# EAGLE schematic STGHW00054_A2 (EAGLE 9.6.2)
Assembly variants: 00054A200000C, 00054A201001C, 00054A202010C, 00054A203011C

## Sheet 1 of 6: Baseband Processor Baseband LoRa demodulation processor and companion MCU
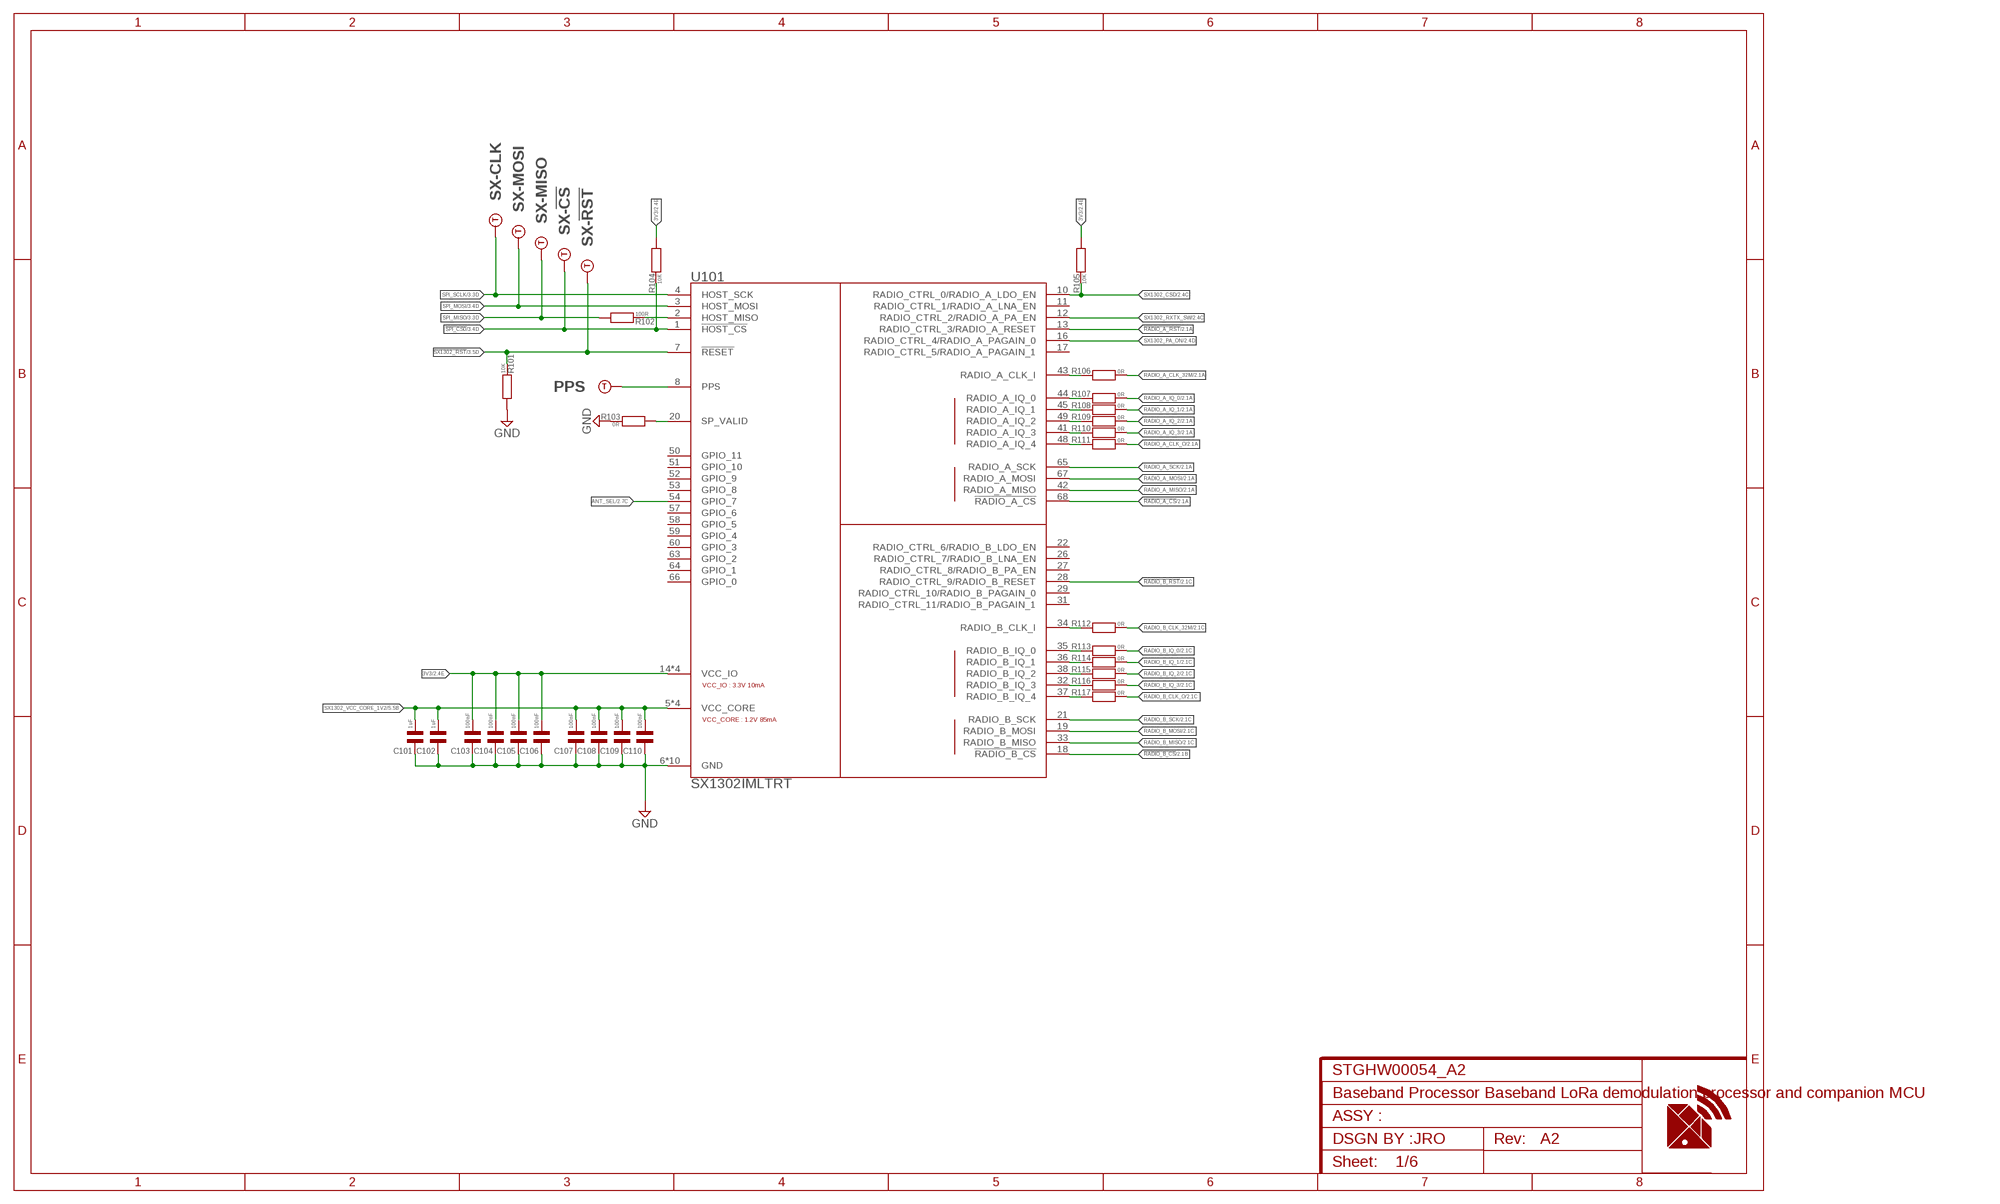
[diagram p0: schematic, sheet 1]

### Parts
C101  1uF  CAPACITOR-NP-0402  [C0402]
C102  1uF  CAPACITOR-NP-0402  [C0402]
C103  100nF  CAPACITOR-NP-0402  [C0402]
C104  100nF  CAPACITOR-NP-0402  [C0402]
C105  100nF  CAPACITOR-NP-0402  [C0402]
C106  100nF  CAPACITOR-NP-0402  [C0402]
C107  100nF  CAPACITOR-NP-0402  [C0402]
C108  100nF  CAPACITOR-NP-0402  [C0402]
C109  100nF  CAPACITOR-NP-0402  [C0402]
C110  100nF  CAPACITOR-NP-0402  [C0402]
PPS  TESPOINT-SMD1.5MM  [TESTPOINT-1.5MM]
R101  10K  RESISTOR-0402  [R0402]
R102  100R  RESISTOR-0402  [R0402]
R103  0R  RESISTOR-0402  [R0402]
R104  10K  RESISTOR-0402  [R0402]
R105  10K  RESISTOR-0402  [R0402]
R106  0R  RESISTOR-0402  [R0402]
R107  0R  RESISTOR-0402  [R0402]
R108  0R  RESISTOR-0402  [R0402]
R109  0R  RESISTOR-0402  [R0402]
R110  0R  RESISTOR-0402  [R0402]
R111  0R  RESISTOR-0402  [R0402]
R112  0R  RESISTOR-0402  [R0402]
R113  0R  RESISTOR-0402  [R0402]
R114  0R  RESISTOR-0402  [R0402]
R115  0R  RESISTOR-0402  [R0402]
R116  0R  RESISTOR-0402  [R0402]
R117  0R  RESISTOR-0402  [R0402]
SX-!CS!  TESPOINT-SMD1.5MM  [TESTPOINT-1.5MM]
SX-!RST!  TESPOINT-SMD1.5MM  [TESTPOINT-1.5MM]
SX-CLK  TESPOINT-SMD1.5MM  [TESTPOINT-1.5MM]
SX-MISO  TESPOINT-SMD1.5MM  [TESTPOINT-1.5MM]
SX-MOSI  TESPOINT-SMD1.5MM  [TESTPOINT-1.5MM]
U101  SX1302IMLTRT  [QFN35P700X700X80-69T556]

### Nets
3V3: C103.2 C104.2 C105.2 C106.2 R104.1 R105.1 U101.14(VCC_IO) U101.30(VCC_IO) U101.47(VCC_IO) U101.61(VCC_IO) ; also sheet 2,3,4,5,6
!RADIO_A_CS!: U101.68(!RADIO_A_CS!) ; also sheet 2
!RADIO_A_RST!: U101.13(RADIO_CTRL_3/RADIO_A_RESET) ; also sheet 2
!RADIO_B_CS!: U101.18(!RADIO_B_CS!) ; also sheet 2
!RADIO_B_RST!: U101.28(RADIO_CTRL_9/RADIO_B_RESET) ; also sheet 2
!SPI_CS0!: R104.2 SX-!CS!.1 U101.1(!HOST_CS!) ; also sheet 3
!SX1302_RST!: R101.2 SX-!RST!.1 U101.7(!RESET!) ; also sheet 3
ANT_SEL: U101.54(GPIO_7) ; also sheet 2
GND: C101.1 C102.1 C103.1 C104.1 C105.1 C106.1 C107.1 C108.1 C109.1 C110.1 R101.1 R103.2 U101.6(GND) U101.9(GND) U101.15(GND) U101.24(GND) U101.25(GND) U101.39(GND) U101.46(GND) U101.55(GND) U101.62(GND) U101.69(GND) ; also sheet 2,3,4,5,6
GPS_PPS: PPS.1 U101.8(PPS)
HOST_MISO: R102.2 U101.2(HOST_MISO)
RADIO_A_CLK_32M: R106.1 ; also sheet 2
RADIO_A_CLK_O: R111.1 ; also sheet 2
RADIO_A_IQ-0: R107.2 U101.44(RADIO_A_IQ_0)
RADIO_A_IQ-1: R108.2 U101.45(RADIO_A_IQ_1)
RADIO_A_IQ-2: R109.2 U101.49(RADIO_A_IQ_2)
RADIO_A_IQ-3: R110.2 U101.41(RADIO_A_IQ_3)
RADIO_A_IQ-4: R111.2 U101.48(RADIO_A_IQ_4)
RADIO_A_IQ_0: R107.1 ; also sheet 2
RADIO_A_IQ_1: R108.1 ; also sheet 2
RADIO_A_IQ_2: R109.1 ; also sheet 2
RADIO_A_IQ_3: R110.1 ; also sheet 2
RADIO_A_MISO: U101.42(RADIO_A_MISO) ; also sheet 2
RADIO_A_MOSI: U101.67(RADIO_A_MOSI) ; also sheet 2
RADIO_A_SCK: U101.65(RADIO_A_SCK) ; also sheet 2
RADIO_ACLK_I: R106.2 U101.43(RADIO_A_CLK_I)
RADIO_B_CLK_32M: R112.1 ; also sheet 2
RADIO_B_CLK_I: R112.2 U101.34(RADIO_B_CLK_I)
RADIO_B_CLK_O: R117.1 ; also sheet 2
RADIO_B_IQ-0: R113.2 U101.35(RADIO_B_IQ_0)
RADIO_B_IQ-1: R114.2 U101.36(RADIO_B_IQ_1)
RADIO_B_IQ-2: R115.2 U101.38(RADIO_B_IQ_2)
RADIO_B_IQ-3: R116.2 U101.32(RADIO_B_IQ_3)
RADIO_B_IQ-4: R117.2 U101.37(RADIO_B_IQ_4)
RADIO_B_IQ_0: R113.1 ; also sheet 2
RADIO_B_IQ_1: R114.1 ; also sheet 2
RADIO_B_IQ_2: R115.1 ; also sheet 2
RADIO_B_IQ_3: R116.1 ; also sheet 2
RADIO_B_MISO: U101.33(RADIO_B_MISO) ; also sheet 2
RADIO_B_MOSI: U101.19(RADIO_B_MOSI) ; also sheet 2
RADIO_B_SCK: U101.21(RADIO_B_SCK) ; also sheet 2
SP_VALID: R103.1 U101.20(SP_VALID)
SPI_MISO: R102.1 SX-MISO.1 ; also sheet 3
SPI_MOSI: SX-MOSI.1 U101.3(HOST_MOSI) ; also sheet 3
SPI_SCLK: SX-CLK.1 U101.4(HOST_SCK) ; also sheet 3
SX1302_CSD: R105.2 U101.10(RADIO_CTRL_0/RADIO_A_LDO_EN) ; also sheet 2
SX1302_PA_ON: U101.16(RADIO_CTRL_4/RADIO_A_PAGAIN_0) ; also sheet 2
SX1302_RXTX_SW: U101.12(RADIO_CTRL_2/RADIO_A_PA_EN) ; also sheet 2
SX1302_VCC_CORE_1V2: C101.2 C102.2 C107.2 C108.2 C109.2 C110.2 U101.5(VCC_CORE) U101.23(VCC_CORE) U101.40(VCC_CORE) U101.56(VCC_CORE) ; also sheet 5
Unconnected: U101.11(RADIO_CTRL_1/RADIO_A_LNA_EN) U101.17(RADIO_CTRL_5/RADIO_A_PAGAIN_1) U101.22(RADIO_CTRL_6/RADIO_B_LDO_EN) U101.26(RADIO_CTRL_7/RADIO_B_LNA_EN) U101.27(RADIO_CTRL_8/RADIO_B_PA_EN) U101.29(RADIO_CTRL_10/RADIO_B_PAGAIN_0) U101.31(RADIO_CTRL_11/RADIO_B_PAGAIN_1) U101.50(GPIO_11) U101.51(GPIO_10) U101.52(GPIO_9) U101.53(GPIO_8) U101.57(GPIO_6) U101.58(GPIO_5) U101.59(GPIO_4) U101.60(GPIO_3) U101.63(GPIO_2) U101.64(GPIO_1) U101.66(GPIO_0)

### Notes on the sheet
- JRO | A2

## Sheet 2 of 6: Radio front end (RFE + LNA/AMP)
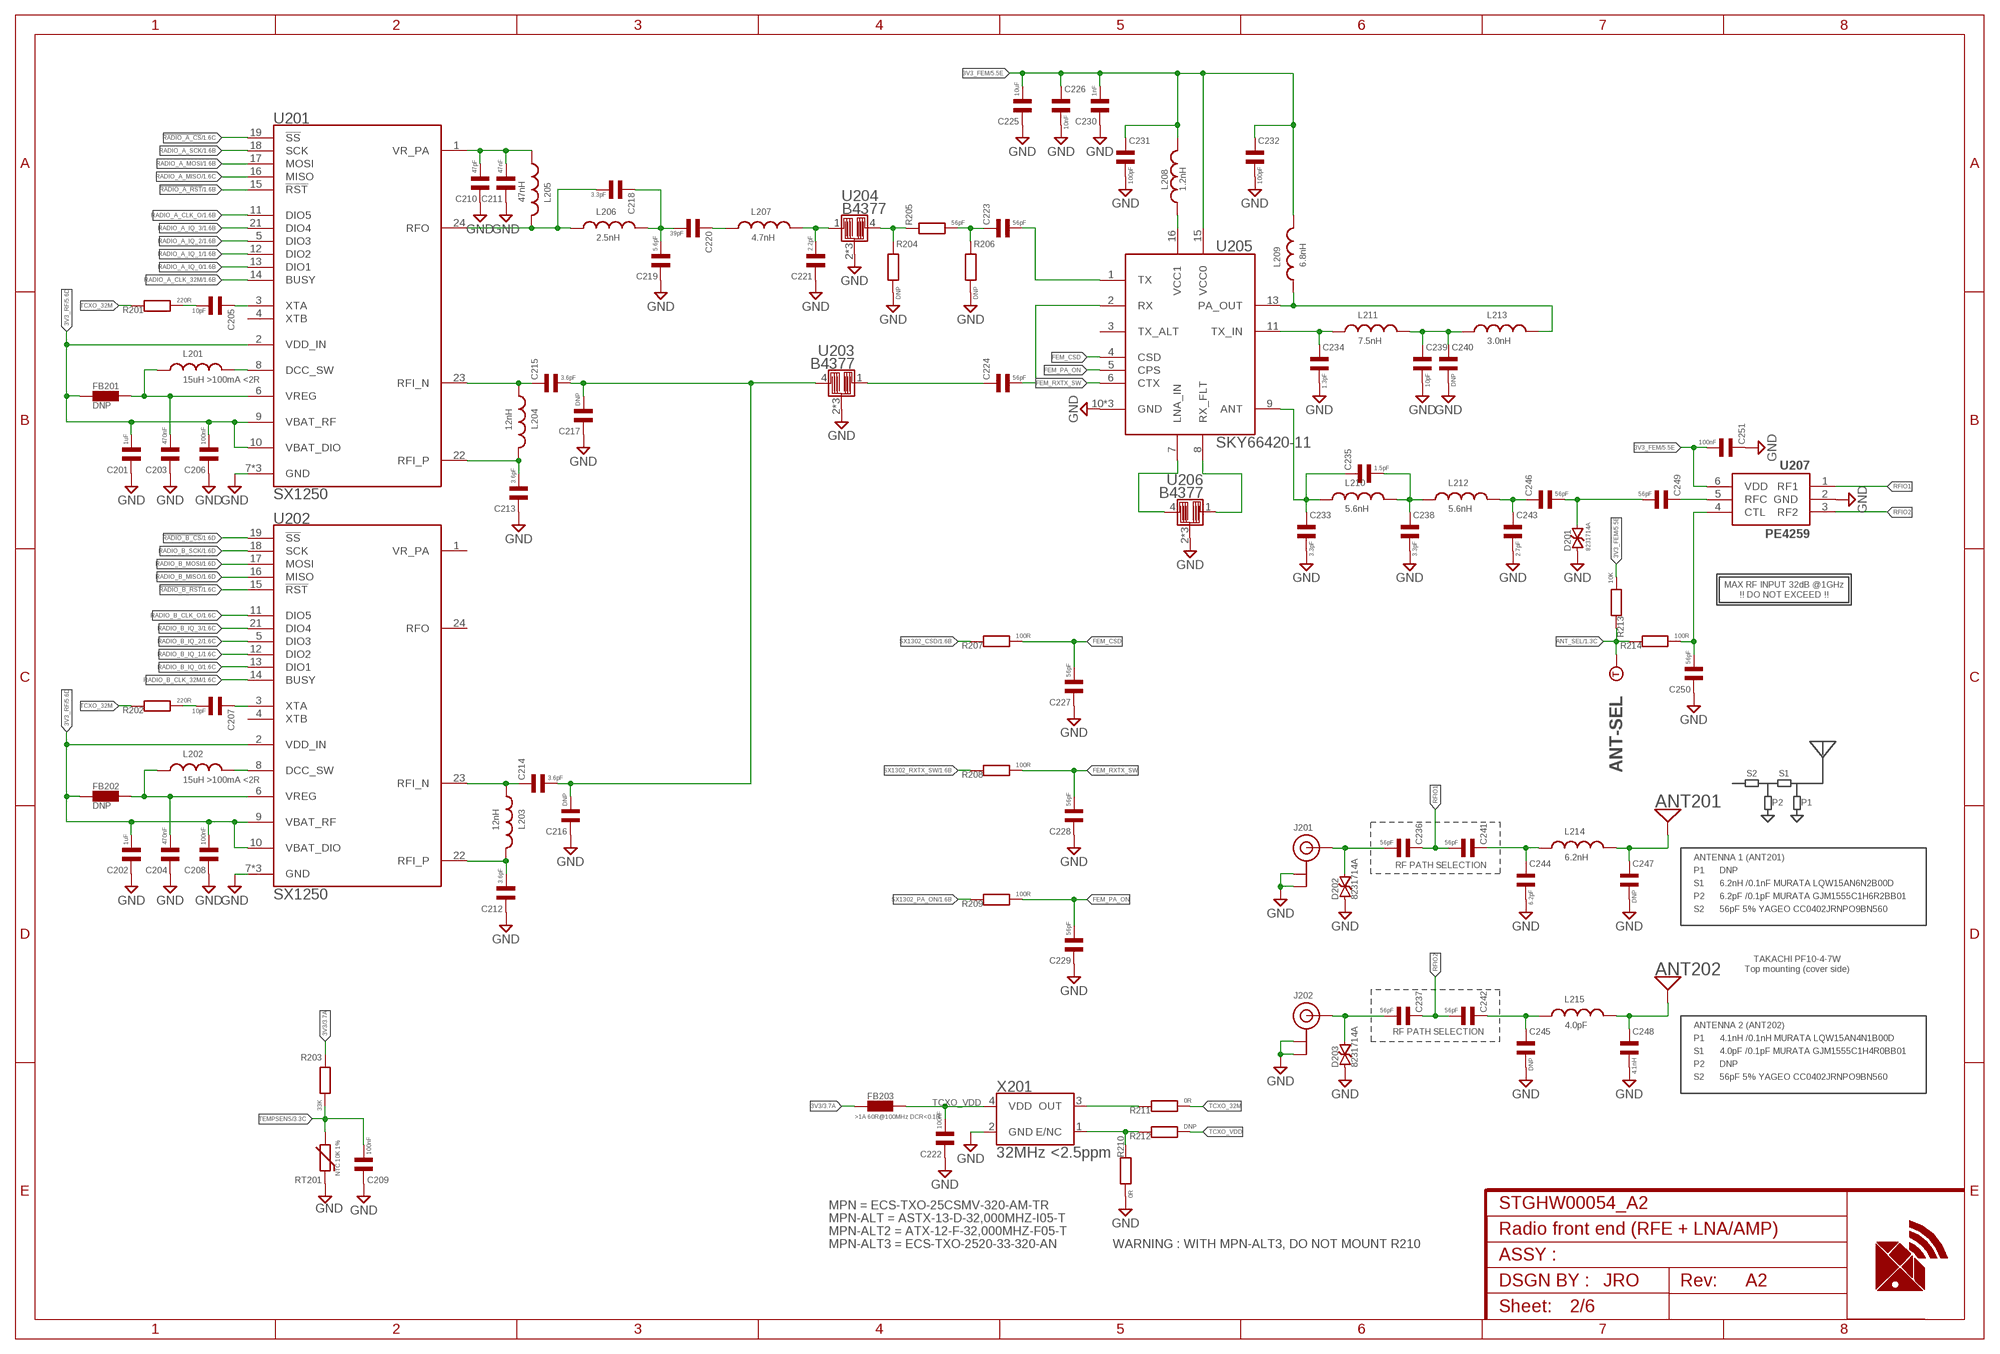
[diagram p1: schematic, sheet 2]

### Parts
ANT201  MLA-DN038  [DN038]
ANT202  MLA-DN038-MIRROR  [DN038_MIRROR]
ANT-SEL  TESPOINT-SMD1.5MM  [TESTPOINT-1.5MM]
C201  1uF  CAPACITOR-NP-0402  [C0402]
C202  1uF  CAPACITOR-NP-0402  [C0402]
C203  470nF  CAPACITOR-NP-0603  [C0603]
C204  470nF  CAPACITOR-NP-0603  [C0603]
C205  10pF  CAPACITOR-NP-0402  [C0402]
C206  100nF  CAPACITOR-NP-0402  [C0402]
C207  10pF  CAPACITOR-NP-0402  [C0402]
C208  100nF  CAPACITOR-NP-0402  [C0402]
C209  100nF  CAPACITOR-NP-0402  [C0402]
C210  47pF  CAPACITOR-NP-0402  [C0402]
C211  47nF  CAPACITOR-NP-0402  [C0402]
C212  3.6pF  CAPACITOR-NP-0402  [C0402]
C213  3.6pF  CAPACITOR-NP-0402  [C0402]
C214  3.6pF  CAPACITOR-NP-0402  [C0402]
C215  3.6pF  CAPACITOR-NP-0402  [C0402]
C216  DNP  CAPACITOR-NP-0402  [C0402]  (not fitted in variant 00054A200000C)  (not fitted in variant 00054A201001C)  (not fitted in variant 00054A202010C)  (not fitted in variant 00054A203011C)
C217  DNP  CAPACITOR-NP-0402  [C0402]  (not fitted in variant 00054A200000C)  (not fitted in variant 00054A201001C)  (not fitted in variant 00054A202010C)  (not fitted in variant 00054A203011C)
C218  3.3pF  CAPACITOR-NP-0402  [C0402]
C219  5.6pF  CAPACITOR-NP-0402  [C0402]
C220  39pF  CAPACITOR-NP-0402  [C0402]
C221  2.2pF  CAPACITOR-NP-0402  [C0402]
C222  100nF  CAPACITOR-NP-0402  [C0402]
C223  56pF  CAPACITOR-NP-0402  [C0402]
C224  56pF  CAPACITOR-NP-0402  [C0402]
C225  10uF  CAPACITOR-NP-0603  [C0603]
C226  10nF  CAPACITOR-NP-0402  [C0402]
C227  56pF  CAPACITOR-NP-0402  [C0402]
C228  56pF  CAPACITOR-NP-0402  [C0402]
C229  56pF  CAPACITOR-NP-0402  [C0402]
C230  1nF  CAPACITOR-NP-0402  [C0402]
C231  100pF  CAPACITOR-NP-0402  [C0402]
C232  100pF  CAPACITOR-NP-0402  [C0402]
C233  3.3pF  CAPACITOR-NP-0402  [C0402]
C234  1.3pF  CAPACITOR-NP-0402  [C0402]
C235  1.5pF  CAPACITOR-NP-0402  [C0402]
C236  56pF  CAPACITOR-NP-0402  [C0402]  (not fitted in variant 00054A200000C)  (not fitted in variant 00054A201001C)
C237  56pF  CAPACITOR-NP-0402  [C0402]  (not fitted in variant 00054A200000C)  (not fitted in variant 00054A201001C)  (not fitted in variant 00054A202010C)  (not fitted in variant 00054A203011C)
C238  3.3pF  CAPACITOR-NP-0402  [C0402]
C239  10pF  CAPACITOR-NP-0402  [C0402]
C240  DNP  CAPACITOR-NP-0402  [C0402]  (not fitted in variant 00054A200000C)  (not fitted in variant 00054A201001C)  (not fitted in variant 00054A202010C)  (not fitted in variant 00054A203011C)
C241  56pF  CAPACITOR-NP-0402  [C0402]  (not fitted in variant 00054A202010C)  (not fitted in variant 00054A203011C)
C242  56pF  CAPACITOR-NP-0402  [C0402]
C243  2.7pF  CAPACITOR-NP-0402  [C0402]
C244  6.2pF  CAPACITOR-NP-0402  [C0402]  (not fitted in variant 00054A202010C)  (not fitted in variant 00054A203011C)
C245  DNP  CAPACITOR-NP-0402  [C0402]  (not fitted in variant 00054A200000C)  (not fitted in variant 00054A201001C)  (not fitted in variant 00054A202010C)  (not fitted in variant 00054A203011C)
C246  56pF  CAPACITOR-NP-0402  [C0402]
C247  DNP  CAPACITOR-NP-0402  [C0402]  (not fitted in variant 00054A200000C)  (not fitted in variant 00054A201001C)  (not fitted in variant 00054A202010C)  (not fitted in variant 00054A203011C)
C248  4.1nH  CAPACITOR-NP-0402  [C0402]
C249  56pF  CAPACITOR-NP-0402  [C0402]
C250  56pF  CAPACITOR-NP-0402  [C0402]
C251  100nF  CAPACITOR-NP-0402  [C0402]
D201  8231714A  TVS-0402  [TVS0402]  (not fitted in variant 00054A200000C)  (not fitted in variant 00054A201001C)  (not fitted in variant 00054A202010C)  (not fitted in variant 00054A203011C)
D202  8231714A  TVS-0402  [TVS0402]  (not fitted in variant 00054A200000C)  (not fitted in variant 00054A201001C)
D203  8231714A  TVS-0402  [TVS0402]  (not fitted in variant 00054A200000C)  (not fitted in variant 00054A201001C)  (not fitted in variant 00054A202010C)  (not fitted in variant 00054A203011C)
FB201  DNP  FERRITE-0402  [FB0402]  (not fitted in variant 00054A200000C)  (not fitted in variant 00054A201001C)  (not fitted in variant 00054A202010C)  (not fitted in variant 00054A203011C)
FB202  DNP  FERRITE-0402  [FB0402]  (not fitted in variant 00054A200000C)  (not fitted in variant 00054A201001C)  (not fitted in variant 00054A202010C)  (not fitted in variant 00054A203011C)
FB203  >1A 60R@100MHz DCR<0.1R  FERRITE-0402  [FB0402]
J201  DNP  UFL_CONNECTOR_AMPHENOL_A-1JB  [U.FL_AMPHENOL_RF_A-1JB]  (not fitted in variant 00054A200000C)  (not fitted in variant 00054A201001C)
J202  DNP  UFL_CONNECTOR_AMPHENOL_A-1JB  [U.FL_AMPHENOL_RF_A-1JB]  (not fitted in variant 00054A200000C)  (not fitted in variant 00054A201001C)  (not fitted in variant 00054A202010C)  (not fitted in variant 00054A203011C)
L201  15uH >100mA <2R  INDUCTOR-0805  [L0805]
L202  15uH >100mA <2R  INDUCTOR-0805  [L0805]
L203  12nH  INDUCTOR-0402  [L0402]
L204  12nH  INDUCTOR-0402  [L0402]
L205  47nH  INDUCTOR-0402  [L0402]
L206  2.5nH  INDUCTOR-0402  [L0402]
L207  4.7nH  INDUCTOR-0402  [L0402]
L208  1.2nH  INDUCTOR-0402  [L0402]
L209  6.8nH  INDUCTOR-0402  [L0402]
L210  5.6nH  INDUCTOR-0402  [L0402]
L211  7.5nH  INDUCTOR-0402  [L0402]
L212  5.6nH  INDUCTOR-0402  [L0402]
L213  3.0nH  INDUCTOR-0402  [L0402]
L214  6.2nH  INDUCTOR-0402  [L0402]  (not fitted in variant 00054A202010C)  (not fitted in variant 00054A203011C)
L215  4.0pF  INDUCTOR-0402  [L0402]
R201  220R  RESISTOR-0402  [R0402]
R202  220R  RESISTOR-0402  [R0402]
R203  33K  RESISTOR-0402  [R0402]
R204  DNP  RESISTOR-0402  [R0402]  (not fitted in variant 00054A200000C)  (not fitted in variant 00054A201001C)  (not fitted in variant 00054A202010C)  (not fitted in variant 00054A203011C)
R205  56pF  RESISTOR-0402  [R0402]
R206  DNP  RESISTOR-0402  [R0402]  (not fitted in variant 00054A200000C)  (not fitted in variant 00054A201001C)  (not fitted in variant 00054A202010C)  (not fitted in variant 00054A203011C)
R207  100R  RESISTOR-0402  [R0402]
R208  100R  RESISTOR-0402  [R0402]
R209  100R  RESISTOR-0402  [R0402]
R210  0R  RESISTOR-0402  [R0402]  (not fitted in variant 00054A200000C)  (not fitted in variant 00054A201001C)  (not fitted in variant 00054A202010C)  (not fitted in variant 00054A203011C)
R211  0R  RESISTOR-0402  [R0402]
R212  DNP  RESISTOR-0402  [R0402]  (not fitted in variant 00054A200000C)  (not fitted in variant 00054A201001C)  (not fitted in variant 00054A202010C)  (not fitted in variant 00054A203011C)
R213  10K  RESISTOR-0402  [R0402]
R214  100R  RESISTOR-0402  [R0402]
RT201  NTC 10K 1%  NTC-THERMISTOR-0402  [R0402]
U201  SX1250  [QFN50P400X400X100-25T270]
U202  SX1250  [QFN50P400X400X100-25T270]
U203  B4377  [B4377]
U204  B4377  [B4377]
U205  SKY66420-11  [QFN50P300X300X80-17T170]
U206  B4377  [B4377]
U207  PE4259  [SC70-6]
X201  32MHz <2.5ppm  TCXO-DUAL-2016-2520  [OSCCC250X200X90N]  (variant 00054A200000C: ECS-TXO-2520-33-320-AN)  (variant 00054A201001C: ECS-TXO-2520-33-320-AN)  (variant 00054A202010C: ECS-TXO-2520-33-320-AN)  (variant 00054A203011C: ECS-TXO-2520-33-320-AN)

### Nets
3V3: FB203.1 R203.1 ; also sheet 1,3,4,5,6
3V3_FEM: C225.2 C226.1 C230.2 C231.1 C232.1 C251.2 L208.2 L209.2 R213.2 U205.15(VCC0) U207.6(VDD) ; also sheet 5
3V3_RF: C201.2 C202.2 C206.2 C208.2 FB201.1 FB202.1 U201.2(VDD_IN) U201.9(VBAT_RF) U201.10(VBAT_DIO) U202.2(VDD_IN) U202.9(VBAT_RF) U202.10(VBAT_DIO) ; also sheet 5
!RADIO_A_CS!: U201.19(!SS!) ; also sheet 1
!RADIO_A_RST!: U201.15(!RST!) ; also sheet 1
!RADIO_B_CS!: U202.19(!SS!) ; also sheet 1
!RADIO_B_RST!: U202.15(!RST!) ; also sheet 1
ANT1 [LORA_RF]: ANT201.FEED C247.1 L214.2
ANT1_MATCH [LORA_RF]: C241.1 C244.1 L214.1
ANT2 [LORA_RF]: ANT202.FEED C248.1 L215.2
ANT2_MATCH [LORA_RF]: C242.1 C245.1 L215.1
ANT_CTL: C250.2 R214.2 U207.4(CTL)
ANT_SEL: ANT-SEL.1 R213.1 R214.1 ; also sheet 1
DCC_SW_RADIO_A: L201.2 U201.8(DCC_SW)
DCC_SW_RADIO_B: L202.2 U202.8(DCC_SW)
FEM_CSD: C227.2 R207.2 U205.4(CSD)
FEM_PA_ON: C229.2 R209.2 U205.5(CPS)
FEM_RXTX_SW: C228.2 R208.2 U205.6(CTX)
GND: C201.1 C202.1 C203.1 C204.1 C206.1 C208.1 C209.1 C210.1 C211.1 C212.1 C213.1 C216.1 C217.1 C219.1 C221.1 C222.1 C225.1 C226.2 C227.1 C228.1 C229.1 C230.1 C231.2 C232.2 C233.2 C234.2 C238.2 C239.2 C240.2 C243.2 C244.2 C245.2 C247.2 C248.2 C250.1 C251.1 D201.1 D202.1 D203.1 J201.1@GND(GND) J201.2@GND(GND) J201.GND J202.1@GND(GND) J202.2@GND(GND) J202.GND R204.2 R206.2 R210.2 RT201.1 U201.7(GND) U201.20(GND) U201.25(GND) U202.7(GND) U202.20(GND) U202.25(GND) U203.2(GND) U203.3(GND) U203.5(GND) U204.2(GND) U204.3(GND) U204.5(GND) U205.10(GND) U205.12(GND) U205.17(GND) U206.2(GND) U206.3(GND) U206.5(GND) U207.2(GND) X201.2(GND) ; also sheet 1,3,4,5,6
LNA_FLTR_IN [LORA_RF]: U205.7(LNA_IN) U206.4(OUT)
N$75: C205.2 R201.2
N$76: C207.2 R202.2
PA_OUT [LORA_RF]: L209.1 L213.2 U205.13(PA_OUT)
PAS_OUTèFLTR [LORA_RF]: C239.1 C240.1 L211.2 L213.1
RADIO_A_CLK_32M: U201.14(BUSY) ; also sheet 1
RADIO_A_CLK_O: U201.11(DIO5) ; also sheet 1
RADIO_A_IQ_0: U201.13(DIO1) ; also sheet 1
RADIO_A_IQ_1: U201.12(DIO2) ; also sheet 1
RADIO_A_IQ_2: U201.5(DIO3) ; also sheet 1
RADIO_A_IQ_3: U201.21(DIO4) ; also sheet 1
RADIO_A_MISO: U201.16(MISO) ; also sheet 1
RADIO_A_MOSI: U201.17(MOSI) ; also sheet 1
RADIO_A_SCK: U201.18(SCK) ; also sheet 1
RADIO_B_CLK_32M: U202.14(BUSY) ; also sheet 1
RADIO_B_CLK_O: U202.11(DIO5) ; also sheet 1
RADIO_B_IQ_0: U202.13(DIO1) ; also sheet 1
RADIO_B_IQ_1: U202.12(DIO2) ; also sheet 1
RADIO_B_IQ_2: U202.5(DIO3) ; also sheet 1
RADIO_B_IQ_3: U202.21(DIO4) ; also sheet 1
RADIO_B_MISO: U202.16(MISO) ; also sheet 1
RADIO_B_MOSI: U202.17(MOSI) ; also sheet 1
RADIO_B_SCK: U202.18(SCK) ; also sheet 1
RFI_FLTR [LORA_RF]: C214.2 C215.2 C216.2 C217.2 U203.4(OUT)
RFI_N_RADIO_A [LORA_RF]: C215.1 L204.1 U201.23(RFI_N)
RFI_N_RADIO_B [LORA_RF]: C214.1 L203.1 U202.23(RFI_N)
RFI_P_RADIO_A [LORA_RF]: C213.2 L204.2 U201.22(RFI_P)
RFI_P_RADIO_B [LORA_RF]: C212.2 L203.2 U202.22(RFI_P)
RFI_RX [LORA_RF]: C224.2 U205.2(RX)
RFI_RX_DCBLK [LORA_RF]: C224.1 U203.1(IN)
RFIO1 [LORA_RF]: C236.1 C241.2 U207.1(RF1)
RFIO2 [LORA_RF]: C237.1 C242.2 U207.3(RF2)
RFO_FLTR [LORA_RF]: C218.1 C219.2 C220.2 L206.2
RFO_FLTR_1 [LORA_RF]: C220.1 L207.1
RFO_FLTR_2 [LORA_RF]: C221.2 L207.2 U204.1(IN)
RFO_RADIO_A [LORA_RF]: C218.2 L205.1 L206.1 U201.24(RFO)
RFO_TX [LORA_RF]: C223.2 U205.1(TX)
RFO_TX_DCBLK [LORA_RF]: C223.1 R205.2 R206.1
RFO_TX_FLTR [LORA_RF]: R204.1 R205.1 U204.4(OUT)
RX_OUT_FLTR [LORA_RF]: U205.8(RX_FLT) U206.1(IN)
SX1302_CSD: R207.1 ; also sheet 1
SX1302_PA_ON: R209.1 ; also sheet 1
SX1302_RXTX_SW: R208.1 ; also sheet 1
TCXO_32M: R201.1 R202.1 R211.2
TCXO_EN: R210.1 R212.1 X201.1(E/NC)
TCXO_OUT: R211.1 X201.3(OUT)
TCXO_VDD: C222.2 FB203.2 R212.2 X201.4(VDD)
TEMPSENS: C209.2 R203.2 RT201.2 ; also sheet 3
TRX_DCBLK [LORA_RF]: C246.2 C249.2 D201.2
TRX_FLTR [LORA_RF]: C235.2 C238.1 L210.2 L212.1
TRX_FLTR_1 [LORA_RF]: C243.1 C246.1 L212.2
TRX_PA [LORA_RF]: C233.1 C235.1 L210.1 U205.9(ANT)
TRX_RF [LORA_RF]: C249.1 U207.5(RFC)
TX_IN [LORA_RF]: C234.1 L211.1 U205.11(TX_IN)
UFL1 [LORA_RF]: C236.2 D202.2 J201.ANT(SIGNAL)
UFL2 [LORA_RF]: C237.2 D203.2 J202.ANT(SIGNAL)
VCC1_PA: L208.1 U205.16(VCC1)
VR_PA_RADIO_A: C210.2 C211.2 L205.2 U201.1(VR_PA)
VREG_RADIO_A: C203.2 FB201.2 L201.1 U201.6(VREG)
VREG_RADIO_B: C204.2 FB202.2 L202.1 U202.6(VREG)
XTA_RADIO_A: C205.1 U201.3(XTA)
XTA_RADIO_B: C207.1 U202.3(XTA)
Unconnected: U201.4(XTB) U202.1(VR_PA) U202.4(XTB) U202.24(RFO) U205.3(TX_ALT)

### Notes on the sheet
- MAX RF INPUT 32dB @1GHz
  !! DO NOT EXCEED !!
- S2 | S1
- P2 | P1
- ANTENNA 1 (ANT201)
- RF PATH SELECTION
- P1 | DNP
- S1 | 6.2nH /0.1nF MURATA LQW15AN6N2B00D
- P2 | 6.2pF /0.1pF MURATA GJM1555C1H6R2BB01
- S2 | 56pF 5% YAGEO CC0402JRNPO9BN560
- TAKACHI PF10-4-7W
  Top mounting (cover side)
- ANTENNA 2 (ANT202)
- RF PATH SELECTION
- P1 | 4.1nH /0.1nH MURATA LQW15AN4N1B00D
- S1 | 4.0pF /0.1pF MURATA GJM1555C1H4R0BB01
- P2 | DNP
- S2 | 56pF 5% YAGEO CC0402JRNPO9BN560
- WARNING : WITH MPN-ALT3, DO NOT MOUNT R210
- JRO | A2

## Sheet 3 of 6: ESP32 Application Processor
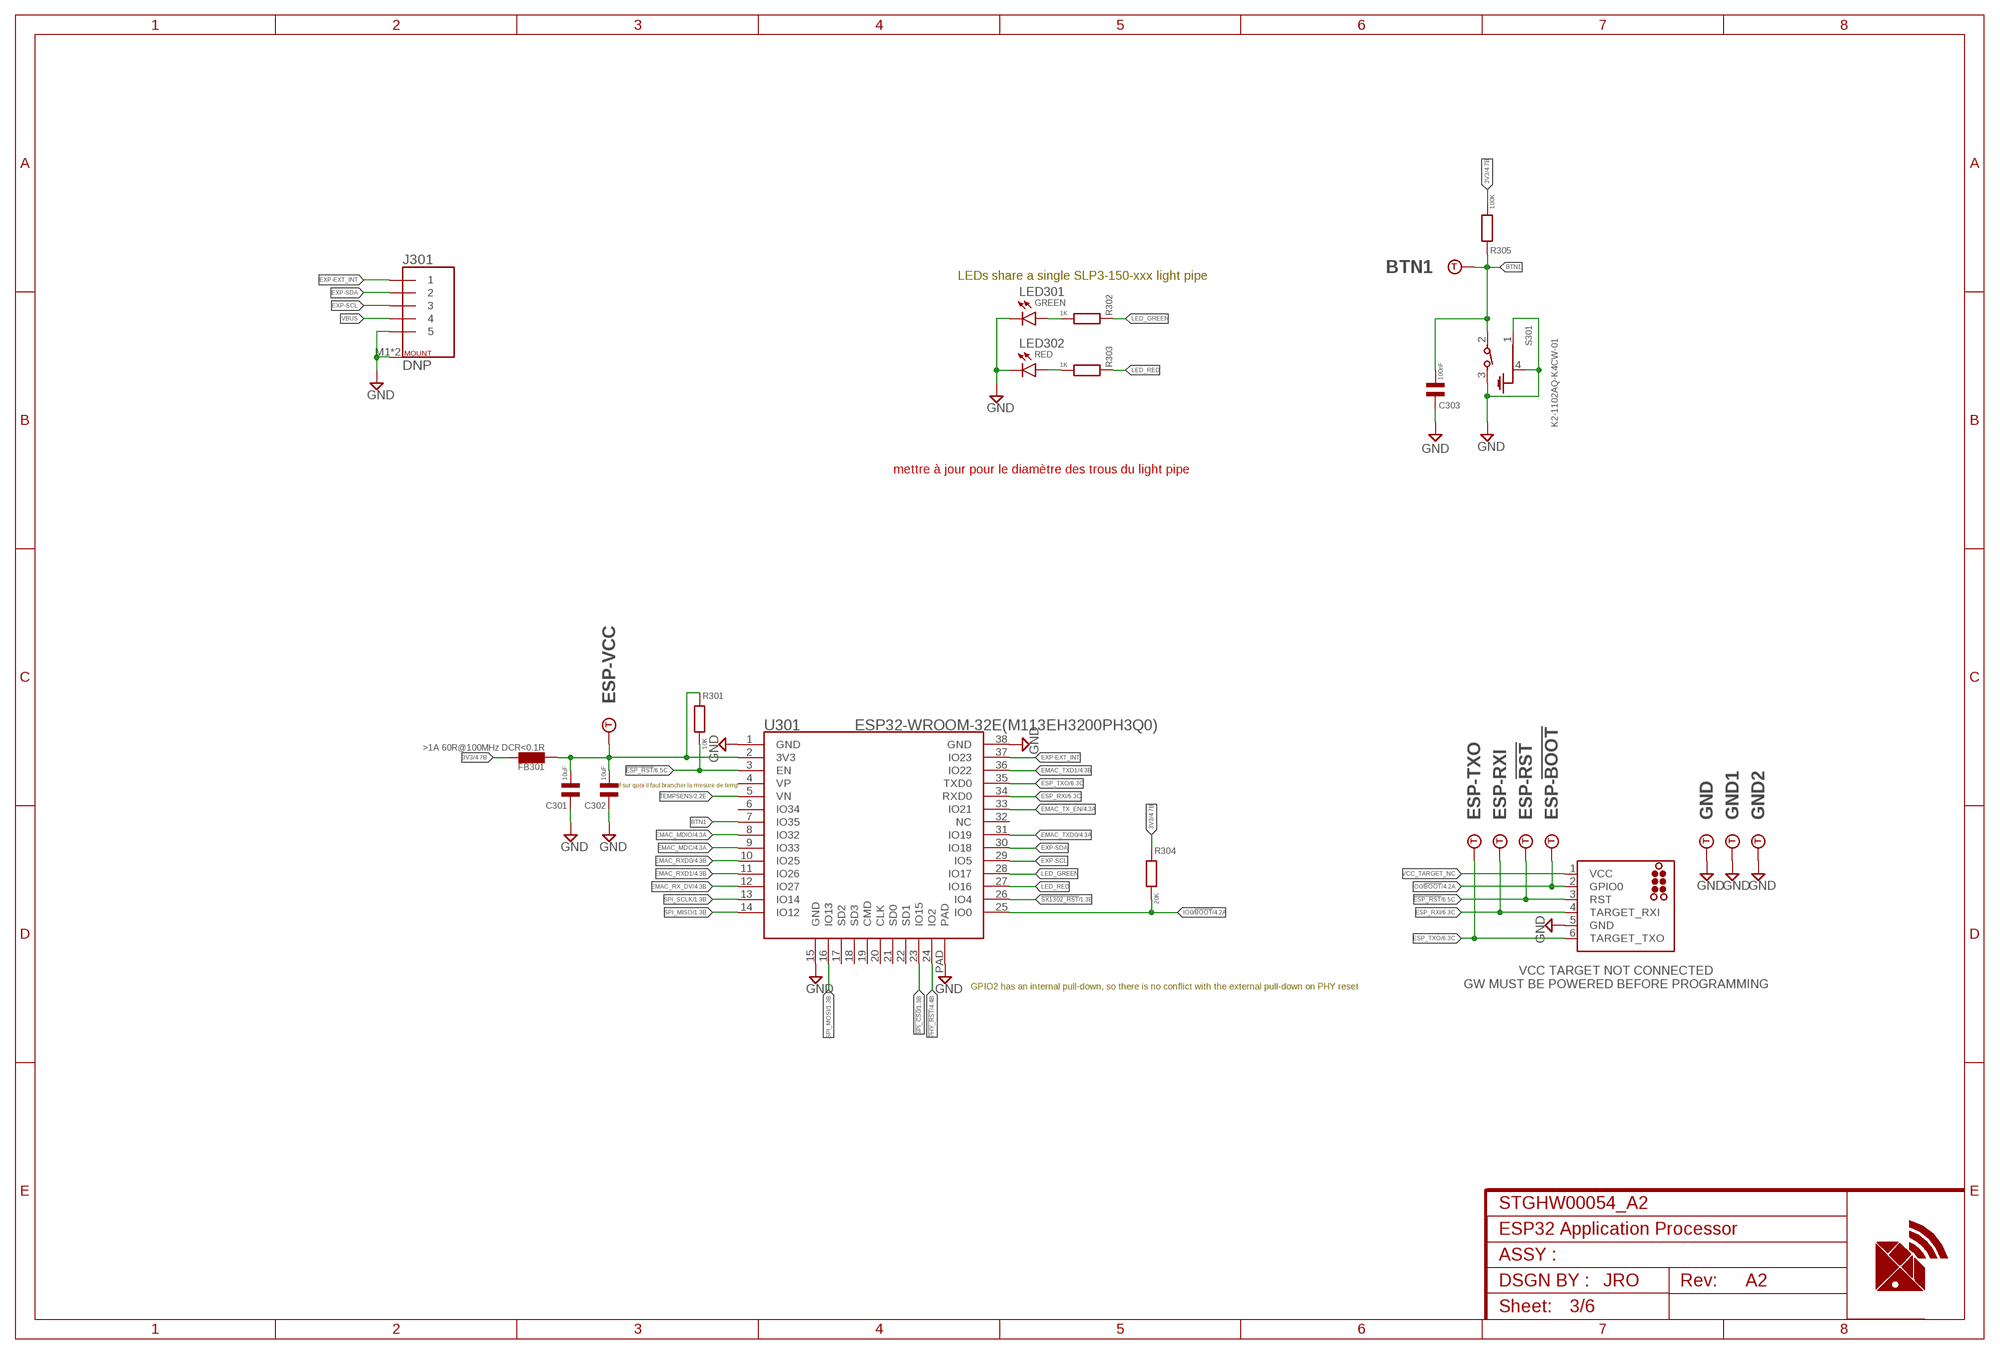
[diagram p2: schematic, sheet 3]

### Parts
BTN1  TESPOINT-SMD1.5MM  [TESTPOINT-1.5MM]
C301  10uF  CAPACITOR-NP-0603  [C0603]
C302  10uF  CAPACITOR-NP-0603  [C0603]
C303  100nF  CAPACITOR-NP-0402  [C0402]
ESP-!BOOT!  TESPOINT-SMD1.5MM  [TESTPOINT-1.5MM]
ESP-!RST!  TESPOINT-SMD1.5MM  [TESTPOINT-1.5MM]
ESP-RXI  TESPOINT-SMD1.5MM  [TESTPOINT-1.5MM]
ESP-TXO  TESPOINT-SMD1.5MM  [TESTPOINT-1.5MM]
ESP-VCC  TESPOINT-SMD1.5MM  [TESTPOINT-1.5MM]
FB301  >1A 60R@100MHz DCR<0.1R  FERRITE-0402  [FB0402]
GND  TESPOINT-SMD1.5MM  [TESTPOINT-1.5MM]
GND1  TESPOINT-SMD1.5MM  [TESTPOINT-1.5MM]
GND2  TESPOINT-SMD1.5MM  [TESTPOINT-1.5MM]
J301  DNP  533980567  [533980567-PICOBLADE-5P-SMT-VER]  (not fitted in variant 00054A200000C)  (not fitted in variant 00054A201001C)  (not fitted in variant 00054A202010C)  (not fitted in variant 00054A203011C)
J302  TC2030-ESP-NL  [TC2030-MCP-NL]  (not fitted in variant 00054A200000C)  (not fitted in variant 00054A201001C)  (not fitted in variant 00054A202010C)  (not fitted in variant 00054A203011C)
LED301  GREEN  LED-0603  [LED0603]
LED302  RED  LED-0603  [LED0603]
R301  10K  RESISTOR-0402  [R0402]
R302  1K  RESISTOR-0402  [R0402]
R303  1K  RESISTOR-0402  [R0402]
R304  20K  RESISTOR-0402  [R0402]
R305  100K  RESISTOR-0402  [R0402]
S301  K2-1102AQ-K4CW-01  TACTILE-SWITCH-GND  [6MM-TH-RA]
U301  ESP32-WROOM-32E(M113EH3200PH3Q0)  ESP32-WROOM-32D  [ESP32-WROOM-32D]

### Nets
3V3: FB301.2 R304.1 R305.2 ; also sheet 1,2,4,5,6
3V3_ESP: C301.2 C302.2 ESP-VCC.1 FB301.1 R301.1 U301.2(3V3)
!ESP_RST!: ESP-!RST!.1 J302.3(RST) R301.2 U301.3(EN) ; also sheet 6
!PHY_RST!: U301.24(IO2) ; also sheet 4
!SPI_CS0!: U301.23(IO15) ; also sheet 1
!SX1302_RST!: U301.26(IO4) ; also sheet 1
BTN1: BTN1.1 C303.2 R305.1 S301.2 U301.7(IO35)
EMAC_MDC: U301.9(IO33) ; also sheet 4
EMAC_MDIO: U301.8(IO32) ; also sheet 4
EMAC_RX_DV: U301.12(IO27) ; also sheet 4
EMAC_RXD0: U301.10(IO25) ; also sheet 4
EMAC_RXD1: U301.11(IO26) ; also sheet 4
EMAC_TX_EN: U301.33(IO21) ; also sheet 4
EMAC_TXD0: U301.31(IO19) ; also sheet 4
EMAC_TXD1: U301.36(IO22) ; also sheet 4
ESP_RXI: ESP-RXI.1 J302.4(TARGET_RXI) U301.34(RXD0) ; also sheet 6
ESP_TXO: ESP-TXO.1 J302.6(TARGET_TXO) U301.35(TXD0) ; also sheet 6
EXP-EXT_INT: J301.1 U301.37(IO23)
EXP-SCL: J301.3 U301.29(IO5)
EXP-SDA: J301.2 U301.30(IO18)
GND: C301.1 C302.1 C303.1 GND1.1 GND2.1 GND.1 J301.5 J301.M1(M) J301.M2(M) J302.5(GND) LED301.K LED302.K S301.1(GND1) S301.3 S301.4(GND) U301.1(GND) U301.15(GND) U301.38(GND) U301.PAD ; also sheet 1,2,4,5,6
GREEN_A: LED301.A R302.2
IO0/!BOOT!: ESP-!BOOT!.1 J302.2(GPIO0) R304.2 U301.25(IO0) ; also sheet 4,6
LED_GREEN: R302.1 U301.28(IO17)
LED_RED: R303.1 U301.27(IO16)
RED_A: LED302.A R303.2
SPI_MISO: U301.14(IO12) ; also sheet 1
SPI_MOSI: U301.16(IO13) ; also sheet 1
SPI_SCLK: U301.13(IO14) ; also sheet 1
TEMPSENS: U301.5(VN) ; also sheet 2
VBUS: J301.4 ; also sheet 5
VCC_TARGET_NC: J302.1(VCC)
Unconnected: U301.4(VP) U301.6(IO34) U301.17(SD2) U301.18(SD3) U301.19(CMD) U301.20(CLK) U301.21(SD0) U301.22(SD1) U301.32(NC)

### Notes on the sheet
- LEDs share a single SLP3-150-xxx light pipe
- mettre à jour pour le diamètre des trous du light pipe
- verif sur quoi il faut brancher la mesure de temp
- VCC TARGET NOT CONNECTED
  GW MUST BE POWERED BEFORE PROGRAMMING
- GPIO2 has an internal pull-down, so there is no conflict with the external pull-down on PHY reset
- JRO | A2

## Sheet 4 of 6: Ethernet PHY
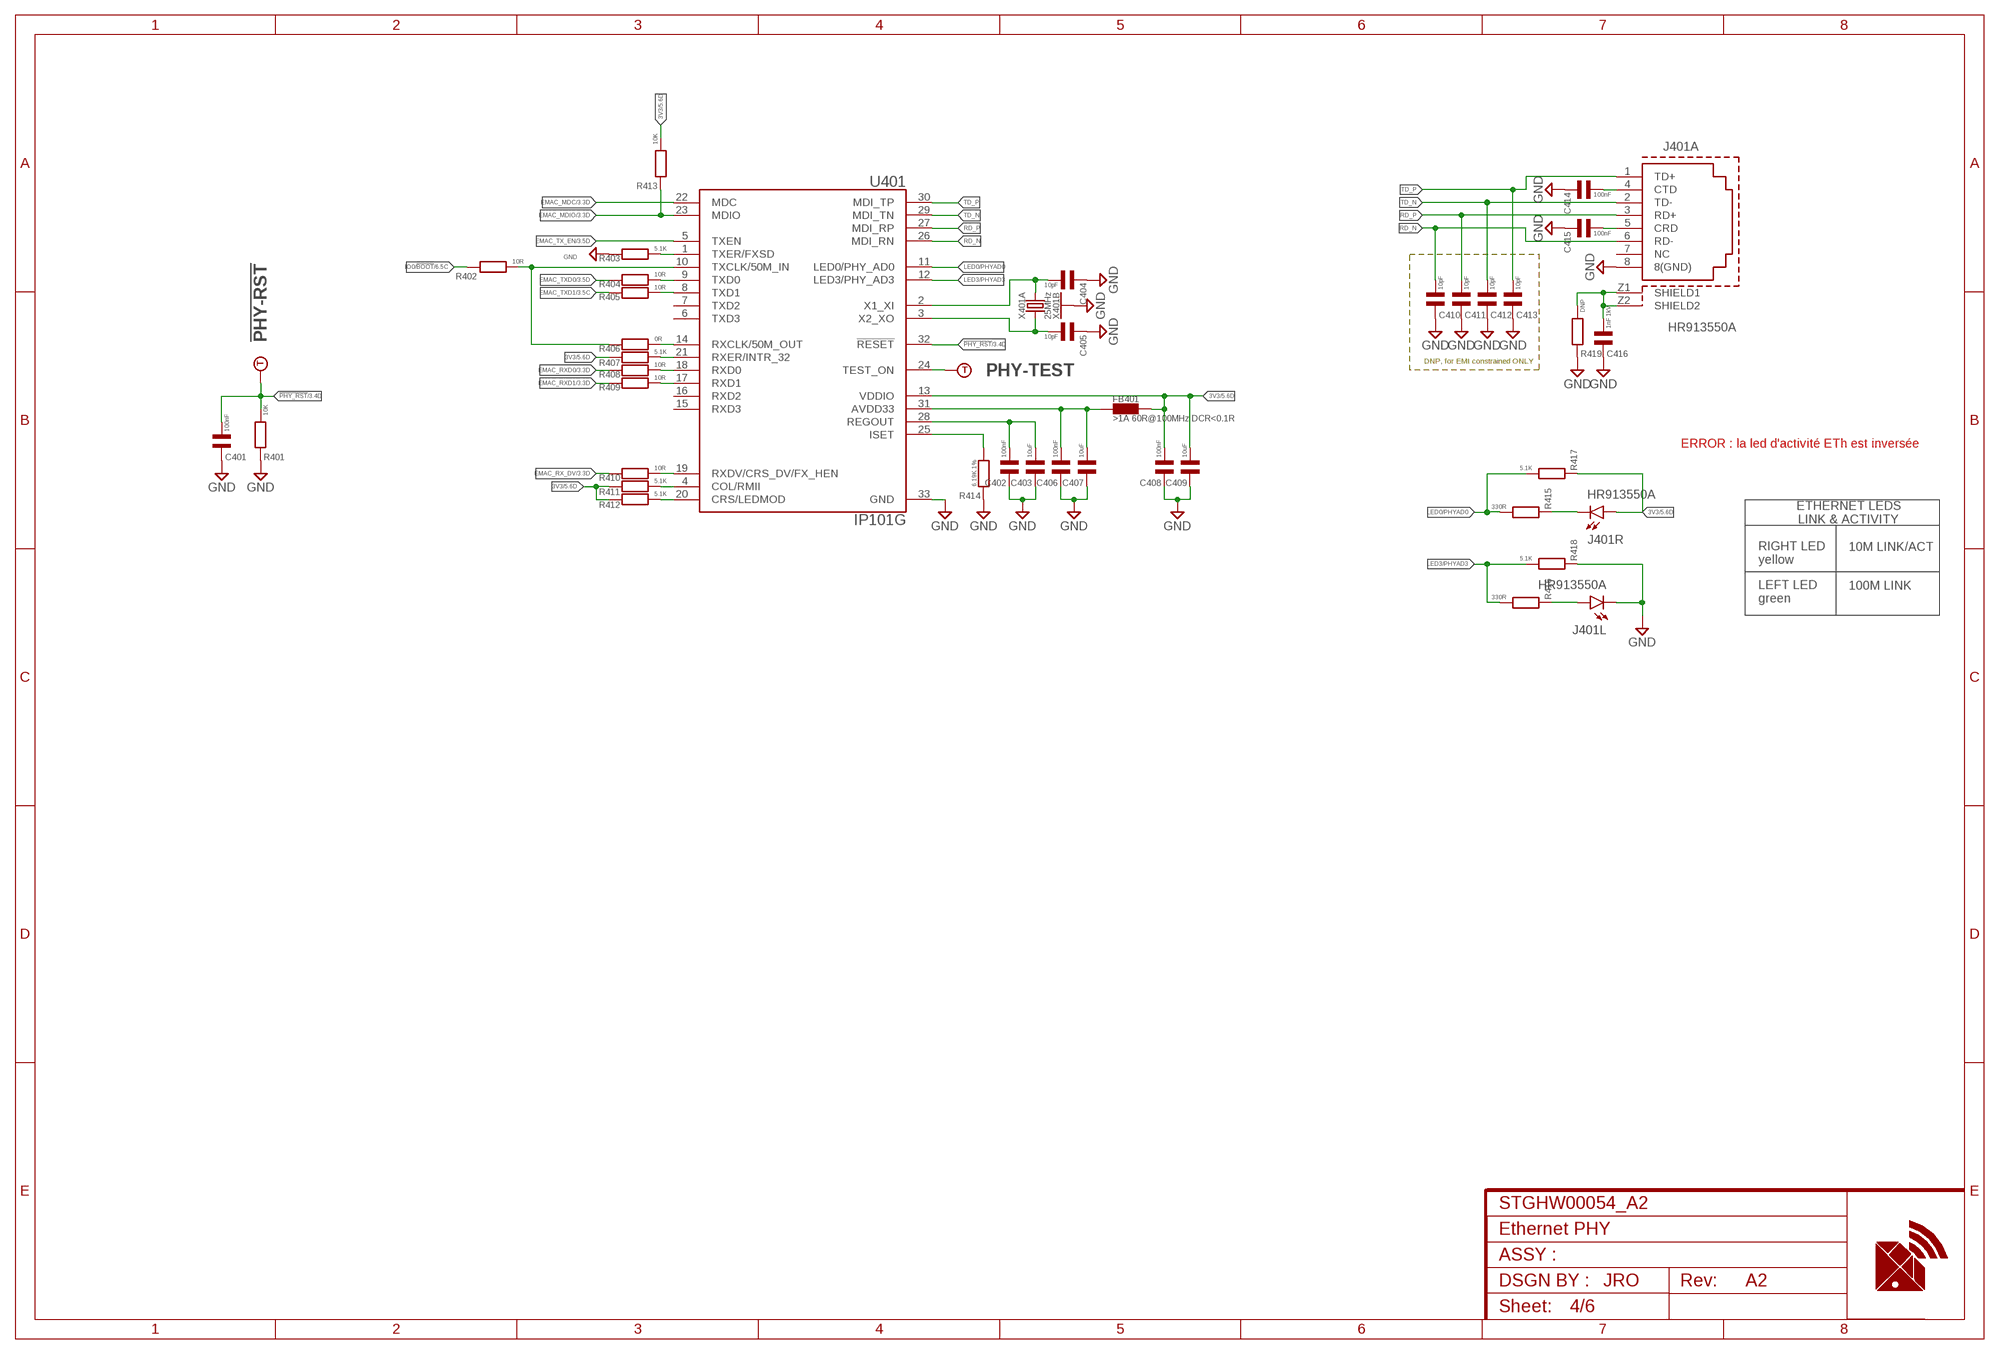
[diagram p3: schematic, sheet 4]

### Parts
!PHY-RST!  TESPOINT-SMD1.5MM  [TESTPOINT-1.5MM]
C401  100nF  CAPACITOR-NP-0402  [C0402]
C402  100nF  CAPACITOR-NP-0402  [C0402]
C403  10uF  CAPACITOR-NP-0603  [C0603]
C404  10pF  CAPACITOR-NP-0402  [C0402]
C405  10pF  CAPACITOR-NP-0402  [C0402]
C406  100nF  CAPACITOR-NP-0402  [C0402]
C407  10uF  CAPACITOR-NP-0603  [C0603]
C408  100nF  CAPACITOR-NP-0402  [C0402]
C409  10uF  CAPACITOR-NP-0603  [C0603]
C410  10pF  CAPACITOR-NP-0402  [C0402]
C411  10pF  CAPACITOR-NP-0402  [C0402]
C412  10pF  CAPACITOR-NP-0402  [C0402]
C413  10pF  CAPACITOR-NP-0402  [C0402]
C414  100nF  CAPACITOR-NP-0402  [C0402]
C415  100nF  CAPACITOR-NP-0402  [C0402]
C416  1nF 1kV  CAPACITOR-NP-1206-H0.8  [C1206-H0.8]
FB401  >1A 60R@100MHz DCR<0.1R  FERRITE-0402  [FB0402]
J401  HR913550A  RJ45  [RJ45_8P_TH_2LED]
PHY-TEST  TESPOINT-SMD1.5MM  [TESTPOINT-1.5MM]
R401  10K  RESISTOR-0402  [R0402]
R402  10R  RESISTOR-0402  [R0402]
R403  5.1K  RESISTOR-0402  [R0402]
R404  10R  RESISTOR-0402  [R0402]
R405  10R  RESISTOR-0402  [R0402]
R406  0R  RESISTOR-0402  [R0402]
R407  5.1K  RESISTOR-0402  [R0402]
R408  10R  RESISTOR-0402  [R0402]
R409  10R  RESISTOR-0402  [R0402]
R410  10R  RESISTOR-0402  [R0402]
R411  5.1K  RESISTOR-0402  [R0402]
R412  5.1K  RESISTOR-0402  [R0402]
R413  10K  RESISTOR-0402  [R0402]
R414  6.19K 1%  RESISTOR-0402  [R0402]
R415  330R  RESISTOR-0402  [R0402]
R416  330R  RESISTOR-0402  [R0402]
R417  5.1K  RESISTOR-0402  [R0402]
R418  5.1K  RESISTOR-0402  [R0402]
R419  DNP  RESISTOR-1206  [R1206]  (not fitted in variant 00054A200000C)  (not fitted in variant 00054A201001C)  (not fitted in variant 00054A202010C)  (not fitted in variant 00054A203011C)
U401  IP101G  [QFN40P400X400X90-33T275N]
X401  25MHz  CRYSTAL-GND-3.5X2.5-4P  [OSCCC350X250X80]

### Nets
3V3: C408.2 C409.2 FB401.2 J401.11(R:A) R407.2 R411.2 R412.2 R413.2 R417.1 U401.13(VDDIO) ; also sheet 1,2,3,5,6
100M_A: J401.9(L:A) R416.1
!PHY_RST!: !PHY-RST!.1 C401.2 R401.2 U401.32(!RESET!) ; also sheet 3
ACT_K: J401.12(R:K) R415.1
AVDD33_IP101: C406.2 C407.2 FB401.1 U401.31(AVDD33)
COL/RMII: R411.1 U401.4(COL/RMII)
CRS/LEDMOD: R412.1 U401.20(CRS/LEDMOD)
EMAC_MDC: U401.22(MDC) ; also sheet 3
EMAC_MDIO: R413.1 U401.23(MDIO) ; also sheet 3
EMAC_RX_DV: R410.1 ; also sheet 3
EMAC_RXD0: R408.1 ; also sheet 3
EMAC_RXD1: R409.1 ; also sheet 3
EMAC_TX_EN: U401.5(TXEN) ; also sheet 3
EMAC_TXD0: R404.1 ; also sheet 3
EMAC_TXD1: R405.1 ; also sheet 3
ETH_SHIELD [CHASSIS_GND]: C416.2 J401.Z1(A:SHIELD1) J401.Z2(A:SHIELD2) R419.2
GND: C401.1 C402.1 C403.1 C404.1 C405.1 C406.1 C407.1 C408.1 C409.1 C410.1 C411.1 C412.1 C413.1 C414.1 C415.1 C416.1 J401.8(A:8(GND)) J401.10(L:K) R401.1 R403.1 R414.1 R418.1 R419.1 U401.33(GND) X401.2 X401.4 ; also sheet 1,2,3,5,6
IO0/!BOOT!: R402.1 ; also sheet 3,6
ISET: R414.2 U401.25(ISET)
LED0/PHYAD0: R415.2 R417.2 U401.11(LED0/PHY_AD0)
LED3/PHYAD3: R416.2 R418.2 U401.12(LED3/PHY_AD3)
RD_N [ETH_DP]: C410.2 J401.6(A:RD-) U401.26(MDI_RN)
RD_P [ETH_DP]: C411.2 J401.3(A:RD+) U401.27(MDI_RP)
REGOUT_IP101: C402.2 C403.2 U401.28(REGOUT)
RJ45-CRD: C415.2 J401.5(A:CRD)
RJ45-CTD: C414.2 J401.4(A:CTD)
RXCLK: R406.2 U401.14(RXCLK/50M_OUT)
RXD0: R408.2 U401.18(RXD0)
RXD1: R409.2 U401.17(RXD1)
RXDV: R410.2 U401.19(RXDV/CRS_DV/FX_HEN)
RXER: R407.1 U401.21(RXER/INTR_32)
TD_N [ETH_DP]: C412.2 J401.2(A:TD-) U401.29(MDI_TN)
TD_P [ETH_DP]: C413.2 J401.1(A:TD+) U401.30(MDI_TP)
TEST-ON_IP101: PHY-TEST.1 U401.24(TEST_ON)
TXCLK: R402.2 R406.1 U401.10(TXCLK/50M_IN)
TXD0: R404.2 U401.9(TXD0)
TXD1: R405.2 U401.8(TXD1)
TXER: R403.2 U401.1(TXER/FXSD)
XI_IP101: C404.2 U401.2(X1_XI) X401.3
XO_IP101: C405.2 U401.3(X2_XO) X401.1
Unconnected: J401.7(A:NC) U401.6(TXD3) U401.7(TXD2) U401.15(RXD3) U401.16(RXD2)

### Notes on the sheet
- DNP, for EMI constrained ONLY
- ERROR : la led d'activité ETh est inversée
- ETHERNET LEDS
  LINK & ACTIVITY
- 10M LINK/ACT
- RIGHT LED
  yellow
- 100M LINK
- LEFT LED
  green
- JRO | A2

## Sheet 5 of 6: Power Supply
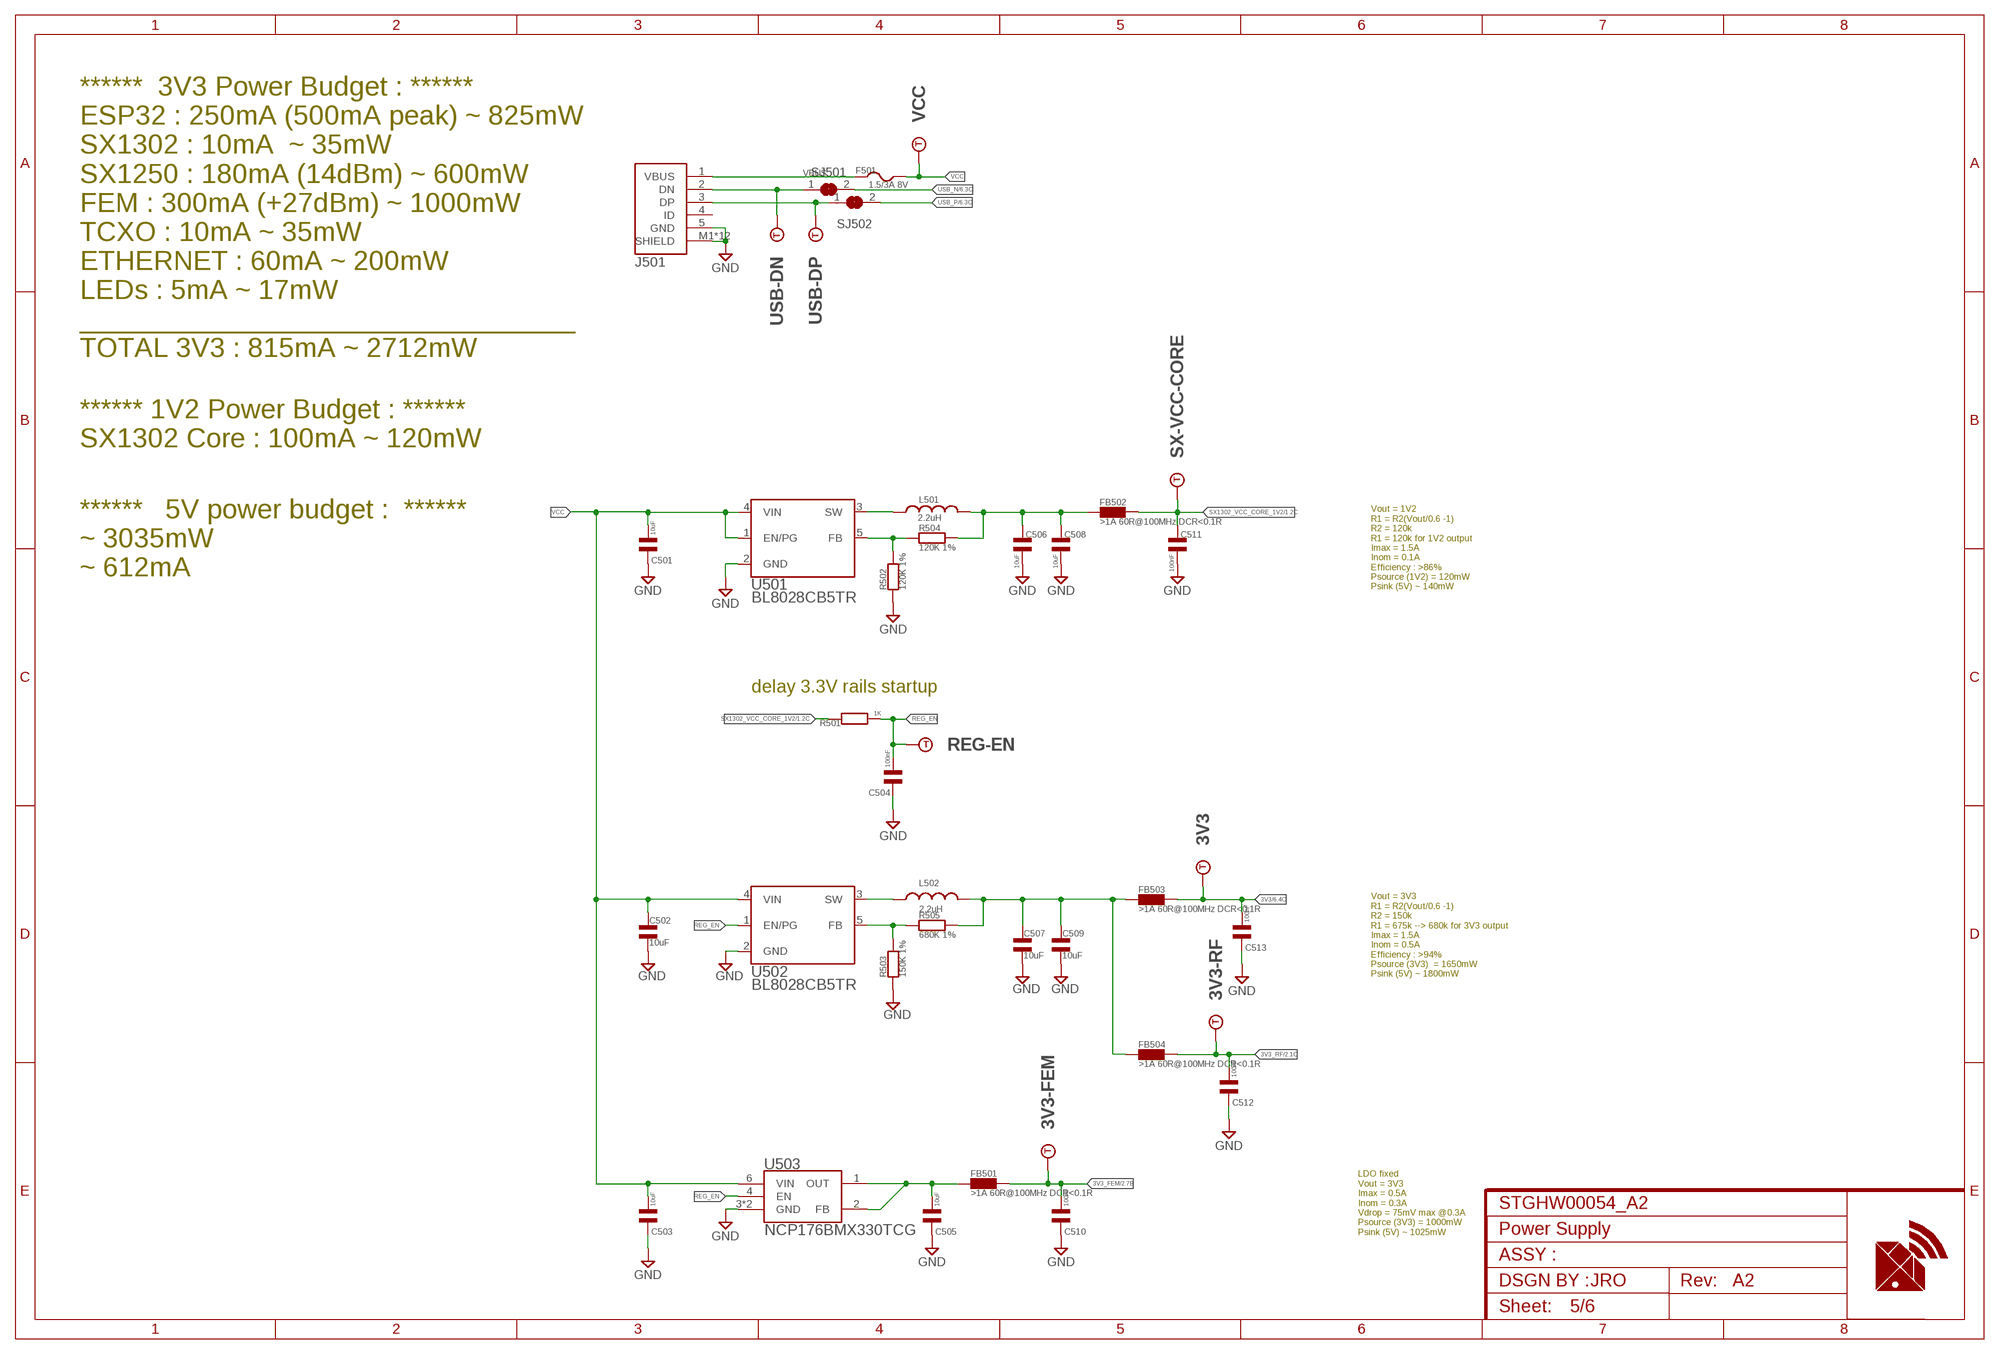
[diagram p4: schematic, sheet 5]

### Parts
3V3  TESPOINT-SMD1.5MM  [TESTPOINT-1.5MM]
3V3-FEM  TESPOINT-SMD1.5MM  [TESTPOINT-1.5MM]
3V3-RF  TESPOINT-SMD1.5MM  [TESTPOINT-1.5MM]
C501  10uF  CAPACITOR-NP-0603  [C0603]
C502  10uF  CAPACITOR-NP-0603  [C0603]
C503  10uF  CAPACITOR-NP-0603  [C0603]
C504  100nF  CAPACITOR-NP-0402  [C0402]
C505  10uF  CAPACITOR-NP-0603  [C0603]
C506  10uF  CAPACITOR-NP-0603  [C0603]
C507  10uF  CAPACITOR-NP-0603  [C0603]
C508  10uF  CAPACITOR-NP-0603  [C0603]
C509  10uF  CAPACITOR-NP-0603  [C0603]
C510  100nF  CAPACITOR-NP-0402  [C0402]
C511  100nF  CAPACITOR-NP-0402  [C0402]
C512  100nF  CAPACITOR-NP-0402  [C0402]
C513  100nF  CAPACITOR-NP-0402  [C0402]
F501  1.5/3A 8V  FUSE1210  [1210]
FB501  >1A 60R@100MHz DCR<0.1R  FERRITE-0402  [FB0402]
FB502  >1A 60R@100MHz DCR<0.1R  FERRITE-0402  [FB0402]
FB503  >1A 60R@100MHz DCR<0.1R  FERRITE-0402  [FB0402]
FB504  >1A 60R@100MHz DCR<0.1R  FERRITE-0402  [FB0402]
J501  U254-051N-4BH806  MICRO_USB  [USB_MICRO_3]
L501  2.2uH  INDUCTOR-1008  [1008]
L502  2.2uH  INDUCTOR-1008  [1008]
R501  1K  RESISTOR-0402  [R0402]
R502  120K 1%  RESISTOR-0402  [R0402]
R503  150K 1%  RESISTOR-0402  [R0402]
R504  120K 1%  RESISTOR-0402  [R0402]
R505  680K 1%  RESISTOR-0402  [R0402]
REG-EN  TESPOINT-SMD1.5MM  [TESTPOINT-1.5MM]
SJ501  JUMPER2-NC-0603  [JUMPER2-0603_NC]  (not fitted in variant 00054A200000C)  (not fitted in variant 00054A202010C)
SJ502  JUMPER2-NC-0603  [JUMPER2-0603_NC]  (not fitted in variant 00054A200000C)  (not fitted in variant 00054A202010C)
SX-VCC-CORE  TESPOINT-SMD1.5MM  [TESTPOINT-1.5MM]
U501  BL8028CB5TR  REG-DC/DC  [SOT95P280X120-5]
U502  BL8028CB5TR  REG-DC/DC  [SOT95P280X120-5]
U503  NCP176BMX330TCG  REG_LDO5P-DFN6  [SON40P120X120X80-7T40X108N]
USB-DN  TESPOINT-SMD1.5MM  [TESTPOINT-1.5MM]
USB-DP  TESPOINT-SMD1.5MM  [TESTPOINT-1.5MM]
VCC  TESPOINT-SMD1.5MM  [TESTPOINT-1.5MM]

### Nets
3V3: 3V3.1 C513.2 FB503.2 ; also sheet 1,2,3,4,6
3V3_FEM: 3V3-FEM.1 C510.2 FB501.2 ; also sheet 2
3V3_RF: 3V3-RF.1 C512.2 FB504.2 ; also sheet 2
DN: J501.2(DN) SJ501.1 USB-DN.1
DP: J501.3(DP) SJ502.1 USB-DP.1
FB_1V2: R502.2 R504.1 U501.5(FB)
FB_3V3: R503.2 R505.1 U502.5(FB)
GND: C501.1 C502.2 C503.1 C504.1 C505.1 C506.1 C507.2 C508.2 C509.2 C510.1 C511.1 C512.1 C513.1 J501.5(GND) J501.M1(SHIELD) J501.M2(SHIELD) J501.M3(SHIELD) J501.M4(SHIELD) J501.MB1(SHIELD) J501.MB2(SHIELD) J501.MB3(SHIELD) J501.MB4(SHIELD) J501.MT1(SHIELD) J501.MT2(SHIELD) J501.MT3(SHIELD) J501.MT4(SHIELD) R502.1 R503.1 U501.2(GND) U502.2(GND) U503.3(GND) U503.7(GND) ; also sheet 1,2,3,4,6
OUT_1V2: C506.2 C508.1 FB502.1 L501.2 R504.2
OUT_3V3: C507.1 C509.1 FB503.1 FB504.1 L502.2 R505.2
OUT_LDO_3V3_FEM: C505.2 FB501.1 U503.1(OUT) U503.2(FB)
REG_EN: C504.2 R501.2 REG-EN.1 U502.1(EN/PG) U503.4(EN)
SW_1V2: L501.1 U501.3(SW)
SW_3V3: L502.1 U502.3(SW)
SX1302_VCC_CORE_1V2: C511.2 FB502.2 R501.1 SX-VCC-CORE.1 ; also sheet 1
USB_N: SJ501.2 ; also sheet 6
USB_P: SJ502.2 ; also sheet 6
VBUS: F501.1 J501.1(VBUS) ; also sheet 3
VCC: C501.2 C502.1 C503.2 F501.2 U501.1(EN/PG) U501.4(VIN) U502.4(VIN) U503.6(VIN) VCC.1
Unconnected: J501.4(ID)

### Notes on the sheet
- ******  3V3 Power Budget : ******
  ESP32 : 250mA (500mA peak) ~ 825mW
  SX1302 : 10mA  ~ 35mW
  SX1250 : 180mA (14dBm) ~ 600mW
  FEM : 300mA (+27dBm) ~ 1000mW
  TCXO : 10mA ~ 35mW
  ETHERNET : 60mA ~ 200mW
  LEDs : 5mA ~ 17mW
  ________________________________
  TOTAL 3V3 : 815mA ~ 2712mW
- ****** 1V2 Power Budget : ******
  SX1302 Core : 100mA ~ 120mW
- ******   5V power budget :  ******
  ~ 3035mW
  ~ 612mA
- Vout = 1V2
  R1 = R2(Vout/0.6 -1)
  R2 = 120k
  R1 = 120k for 1V2 output
  Imax = 1.5A
  Inom = 0.1A
  Efficiency : >86%
  Psource (1V2) = 120mW
  Psink (5V) ~ 140mW
- delay 3.3V rails startup
- Vout = 3V3
  R1 = R2(Vout/0.6 -1)
  R2 = 150k
  R1 = 675k --> 680k for 3V3 output
  Imax = 1.5A
  Inom = 0.5A
  Efficiency : >94%
  Psource (3V3)  = 1650mW
  Psink (5V) ~ 1800mW
- LDO fixed
  Vout = 3V3
  Imax = 0.5A
  Inom = 0.3A
  Vdrop = 75mV max @0.3A
  Psource (3V3) = 1000mW
  Psink (5V) ~ 1025mW
- JRO | A2

## Sheet 6 of 6: Optional USB DEBUG interface
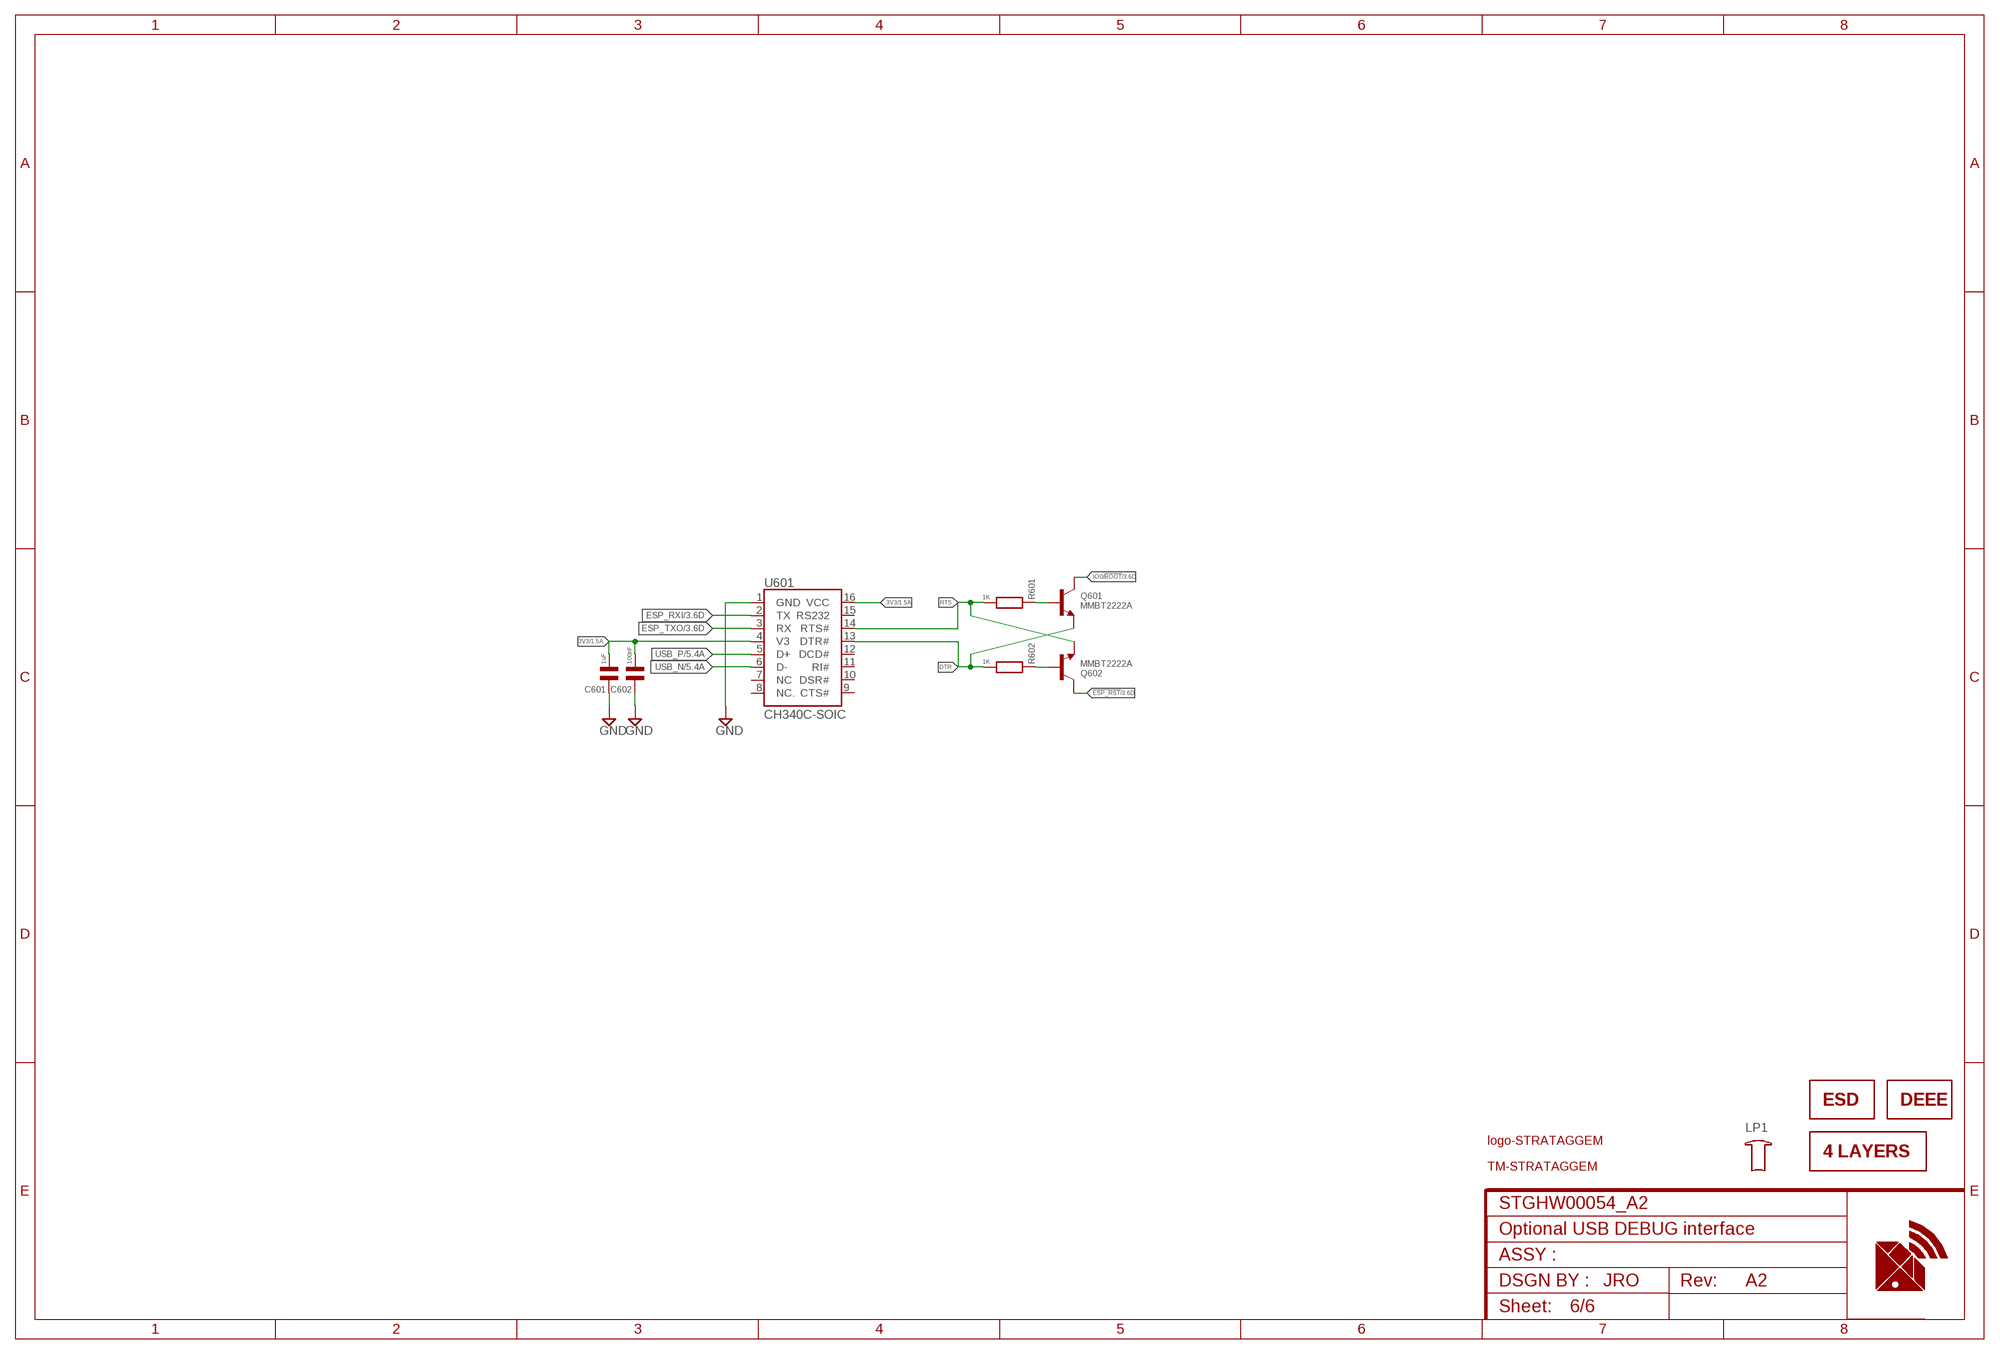
[diagram p5: schematic, sheet 6]

### Parts
C601  1uF  CAPACITOR-NP-0603  [C0603]  (not fitted in variant 00054A200000C)  (not fitted in variant 00054A202010C)
C602  100nF  CAPACITOR-NP-0603  [C0603]  (not fitted in variant 00054A200000C)  (not fitted in variant 00054A202010C)
LOGO1  LOGO_STRATAGGEM_SILK_5  [STG_LOGO_1L_SILK_5]
LOGO601  ESD_LOGO-SILK-TOP-5  [ESD_TOP_5MM]
LOGO602  DEEE_LOGO-SILK-TOP-5  [DEEE_MUELLTONNE_TOP_5MM]
LP1  SLP3-150-250-F  [SLP3-150-250-F]
Q601  MMBT2222A  TRANSISTOR_NPNWIDE  [SOT23-WIDE]  (not fitted in variant 00054A200000C)  (not fitted in variant 00054A202010C)
Q602  MMBT2222A  TRANSISTOR_NPNWIDE  [SOT23-WIDE]  (not fitted in variant 00054A200000C)  (not fitted in variant 00054A202010C)
R601  1K  RESISTOR-0603  [R0603]  (not fitted in variant 00054A200000C)  (not fitted in variant 00054A202010C)
R602  1K  RESISTOR-0603  [R0603]  (not fitted in variant 00054A200000C)  (not fitted in variant 00054A202010C)
SPEC1  LAYER_4  [4LAYER]
TM1  TM_STRATAGGEM_SILK_20  [STG_MARK_SILK_TOP_20MM]
U601  CH340C-SOIC  [SOIC127P600X175-16]  (not fitted in variant 00054A200000C)  (not fitted in variant 00054A202010C)

### Nets
3V3: C601.2 C602.2 U601.4(V3) U601.16(VCC) ; also sheet 1,2,3,4,5
!ESP_RST!: Q602.3(C) ; also sheet 3
DTR: Q601.2(E) R602.2 U601.13(DTR#)
ESP_RXI: U601.2(TX) ; also sheet 3
ESP_TXO: U601.3(RX) ; also sheet 3
GND: C601.1 C602.1 U601.1(GND) ; also sheet 1,2,3,4,5
IO0/!BOOT!: Q601.3(C) ; also sheet 3,4
N$59: Q601.1(B) R601.1
N$60: Q602.1(B) R602.1
RTS: Q602.2(E) R601.2 U601.14(RTS#)
USB_N: U601.6(D-) ; also sheet 5
USB_P: U601.5(D+) ; also sheet 5
Unconnected: U601.7(NC) U601.8(NC.) U601.9(CTS#) U601.10(DSR#) U601.11(RI#) U601.12(DCD#) U601.15(RS232)

### Notes on the sheet
- JRO | A2

## Library data of the parts
3V3 3V3-FEM 3V3-RF !PHY-RST! ANT-SEL BTN1 ESP-!BOOT! ESP-!RST! ESP-RXI ESP-TXO ESP-VCC GND GND1 GND2 PHY-TEST PPS REG-EN SX-!CS! SX-!RST! SX-CLK SX-MISO SX-MOSI SX-VCC-CORE USB-DN USB-DP VCC = Generics_stg:TESPOINT
ANT201 ANT202 = Antenna:MLA
C101 C102 C201 C202 = Generics_stg:CAPACITOR-NP; MPN: CL05A105KO5NNNC
C103-C110 C206 C208 C209 C222 C251 C303 C401 C402 C406 C408 C414 C415 C504 C510-C513 = Generics_stg:CAPACITOR-NP; MPN: CC0402KRX7R7BB104
C203 C204 = Generics_stg:CAPACITOR-NP; MPN: CL10B474KO8NNNC
C205 C207 C239 C404 C405 C410-C413 = Generics_stg:CAPACITOR-NP; MPN: CC0402JRNPO9BN100
C210 = Generics_stg:CAPACITOR-NP; MPN: 0402N470F500CT; MPN-ALT: CC0402FRNPO9BN470; MPN-ALT2: GJM1555C1H470FB01D
C211 = Generics_stg:CAPACITOR-NP; MPN: 0402B473K250CT; MPN-ALT: CC0402KRX7R9BB473; MPN-ALT2: GRM155R71E473KA88D
C212-C215 = Generics_stg:CAPACITOR-NP; MPN: GJM1555C1H3R6BB01D
C216 C217 C240 C245 C247 = Generics_stg:CAPACITOR-NP
C218 C233 C238 = Generics_stg:CAPACITOR-NP; MPN: GJM1555C1H3R3BB01D
C219 = Generics_stg:CAPACITOR-NP; MPN: GJM1555C1H5R6BB01D
C220 = Generics_stg:CAPACITOR-NP; MPN: GJM1555C1H390FB01D
C221 = Generics_stg:CAPACITOR-NP; MPN: GJM1555C1H2R2BB01D
C223 C224 C227-C229 C236 C237 C241 C242 C246 C249 C250 = Generics_stg:CAPACITOR-NP; MPN: CC0402JRNPO9BN560
C225 C301 C302 C403 C407 C409 C501-C503 C505-C509 = Generics_stg:CAPACITOR-NP; MPN: CL10A106KP8NNNC
C226 = Generics_stg:CAPACITOR-NP; MPN: CC0402KRX7R9BB103
C230 = Generics_stg:CAPACITOR-NP; MPN: CC0402KRX7R9BB102
C231 C232 = Generics_stg:CAPACITOR-NP; MPN: CC0402JRNPO9BN101
C234 = Generics_stg:CAPACITOR-NP; MPN: GJM1555C1H1R3BB01D
C235 = Generics_stg:CAPACITOR-NP; MPN: GJM1555C1H1R5BB01D
C243 = Generics_stg:CAPACITOR-NP; MPN: GJM1555C1H2R7BB01D
C244 = Generics_stg:CAPACITOR-NP; MPN: GJM1555C1H6R2BB01D
C248 = Generics_stg:CAPACITOR-NP; MPN: LQW15AN4N1B00D
C416 = Generics_stg:CAPACITOR-NP; MPN: FV31X102K102ECG
C601 = Generics_stg:CAPACITOR-NP; MPN: CL10B105KP8NNNC
C602 = Generics_stg:CAPACITOR-NP; MPN: CL10B104KO8NNNC
D201-D203 = Generics_stg:TVS; MPN: 8231714A
F501 = Generics_stg:FUSE: PTC PPTC FUSE RESETABLE; MPN: 1206L150THWR; MPN-ALT: MF-NSMF150-2
FB201-FB203 FB301 FB401 FB501-FB504 = Generics_stg:FERRITE; MPN: BLM15PD600SN1D
J201 J202 = Antenna-Connectors-STG:UFL_CONNECTOR_AMPHENOL_A-1JB: uFL connector A-1JB Manufacturer: Amphenol RF Type: Jack ? Impedance: 50 Ohms ? Maximum Frequency: 6 GHz ? Termination Style: PCB - Surface Mount ? Orientation: Straight; MPN: U.FL-R-SMT-1(80); MPN-ALT: A-1JB
J301 = Molex:533980567; MPN: C37886 (MX 1.25T-5P); MPN-ALT: 1.25T-5P-WV; MPN-ALT2: 533980567
J302 = TagConnect_stg:TC2030-ESP
J401 = Generics_stg:RJ45: RJ45 LAN Transformer 10/100 Base-T 0-85°C MPN : HANRUN HR913550A datasheet : https://datasheet.lcsc.com/lcsc/Zhongshan-HanRun-Elec-HR913550A_C163507.pdf 10/100 Base-T -40-85°C MPN : HANRUN HR913550AE datasheet : https://datasheet.lcsc.com/lcsc/1811142011_HANRUN-Zhongshan-HanRun-Elec-HR913550AE_C192706.pdf; MPN: HR913550A; MPN-ALT: 7499010441
J501 = Generics_stg:MICRO_USB
L201 L202 = Generics_stg:INDUCTOR; MPN: MLZ2012M150WT000; MPN-ALT: CB2012T150K
L203 L204 = Generics_stg:INDUCTOR; MPN: LQW15AN12NG00D; MPN-ALT: LQW15AN12NH00D
L205 = Generics_stg:INDUCTOR; MPN: LQW15AN47NG00D; MPN-ALT: LQW15AN47NH00D; MPN-ALT2: LQW15AN47NJ00D
L206 = Generics_stg:INDUCTOR; MPN: LQW15AN2N5C00D; MPN-ALT: LQW15AN2N5B00D
L207 = Generics_stg:INDUCTOR; MPN: LQW15AN4N7C00D; MPN-ALT: LQW15AN4N7B00D
L208 = Generics_stg:INDUCTOR; MPN: LQG15HS1N2B02D
L209 = Generics_stg:INDUCTOR; MPN: LQW15AN6N8G80D
L210 L212 = Generics_stg:INDUCTOR; MPN: LQW15AN5N6C10D; MPN-ALT: LQW15AN5N6D10D; MPN-ALT2: LQW15AN5N6B80D
L211 = Generics_stg:INDUCTOR; MPN: LQW15AN7N5G00D; MPN-ALT: LQW15AN7N5H00D; MPN-ALT2: LQW15AN7N5J00D
L213 = Generics_stg:INDUCTOR; MPN: LQW15AN3N0C80D; MPN-ALT: LQW15AN3N0B80D
L214 = Generics_stg:INDUCTOR; MPN: LQW15AN6N2B00D; MPN-ALT: LQW15AN6N2B80D
L215 = Generics_stg:INDUCTOR; MPN: GJM1555C1H4R0BB01D
L501 L502 = Generics_stg:INDUCTOR; MPN: 252012CDMCDDS-2R2MC
LED301 = Generics_stg:LED; MPN: ORH-G36G
LED302 = Generics_stg:LED; MPN: ORH-R36A
LOGO1 = LOGO:LOGO_STRATAGGEM
LOGO601 = LOGO:ESD_LOGO
LOGO602 = LOGO:DEEE_LOGO
LP1 = Bivar:SLP3-150-250-F
Q601 Q602 = Generics_stg:TRANSISTOR_NPN: NPN Transistor Transistor (NPN) 500mA 45V - BC817 [Digikey: 568-1631-1-ND] Transistor (NPN) 500mA 45V - BC817,215 [Mouser: 771-BC817-T/R] SOT23-R - SOT23 footprint optimised for use with solder paste and reflow ovens. SOT23-W - SOT23 footprint optimised for hand-soldering (larger pads).; MPN: MMBT2222A
R101 R104 R105 R203 R213 R301 R401 R413 = Generics_stg:RESISTOR; MPN: RC0402JR-0710KL
R102 R207-R209 R214 = Generics_stg:RESISTOR; MPN: RC0402JR-07100RL
R103 R106-R117 R210-R212 R406 = Generics_stg:RESISTOR; MPN: RC0402JR-070RL
R201 R202 = Generics_stg:RESISTOR; MPN: 0402WGF2200TCE
R204 R206 = Generics_stg:RESISTOR
R205 = Generics_stg:RESISTOR; MPN: CC0402JRNPO9BN560
R302 R303 R501 = Generics_stg:RESISTOR; MPN: 0402WGF1001TCE
R304 = Generics_stg:RESISTOR; MPN: 0402WGF2002TCE
R305 = Generics_stg:RESISTOR; MPN: 0402WGF1003TCE
R402 R404 R405 R408-R410 = Generics_stg:RESISTOR; MPN: RC0402JR-0710RL
R403 R407 R411 R412 R417 R418 = Generics_stg:RESISTOR; MPN: 0402WGF5101TCE
R414 = Generics_stg:RESISTOR; MPN: 0402WGF6191TCE
R415 R416 = Generics_stg:RESISTOR; MPN: 0402WGF3300TCE
R419 = Generics_stg:RESISTOR; MPN: WR04X0000FTL
R502 R504 = Generics_stg:RESISTOR; MPN: 0402WGF1203TCE
R503 = Generics_stg:RESISTOR; MPN: WR04X1503FTL
R505 = Generics_stg:RESISTOR; MPN: WR04X6803FTL
R601 R602 = Generics_stg:RESISTOR; MPN: WR06X1001FTL
RT201 = Generics_stg:NTC-THERMISTOR; MPN: NCP15XH103F03RC
S301 = Generics_stg:TACTILE-SWITCH-GND: THT Tact Switch 6x6 mm Material Properties Cover Material : Carbon Steel Properties Actuator Material:LCP Actuator Flammability Rating:UL94 V-0 Actuator Color:Black; Salmon; White Frame Material:PPA Frame Flammability Rating:UL94 HB Frame Color:Black Contact Material:Stainless Steel Contact Plating:Silver Terminal Material:Copper Alloy Terminal Plating:Silver VR:12 V (DC) Contact Resistance Initial:100 mΩ Contact Resistance After Life Test:2 Ω RISO:100 MΩ Withstanding Voltage:250 V (AC) Qty.:500 Mechanical Properties Stroke 0.25 mm General Information Operating Temperature:-40 up to +85 °C; H: 8.35mm; MPN: K2-1102AQ-K4CW-01
SJ501 SJ502 = we-rcl:JUMPER2-NC: 2 Pin Jumpers Normally Closed
SPEC1 = Frame_Strataggem:LAYER_4
TM1 = LOGO:TM_STRATAGGEM
U101 = Semtech:SX1302IMLTRT: Semtech LoRa concentrator SX1302IMLTRT (SX1302); MPN: SX1302IMLTRT
U201 U202 = Semtech:SX1250; MPN: SX1250IMLTRT
U203 U204 U206 = RF360_Qualcomm_TDK:B4377: Qualcomm TDK venture (RF360) Saw pass filter; MPN: B39871B4377P810
U205 = Skyworks:SKY66420-11: Skyworks SKY66420-11 Radio Front-End Module; MPN: SKY66420-11
U207 = Peregrine:PE4259: Peregrine (psemi) PE4259 RF switch spdt 10MHz-3GHz; MPN: PE4259-63
U301 = Espressif:ESP32-WROOM-32D; MPN: ESP32-WROOM-32E(M113EH3200PH3Q0)
U401 = WIZNet:IP101G; MPN: IP101GR
U501 U502 = Regulator_stg:REG-DC/DC: Buck : TLV62565, TLV62568, BL8028, LN3406, LP3219; MPN: BL8028CB5TR
U503 = Generics_stg:REG_LDO5P: MIC5528, NCP176A; MPN: NCP176BMX330TCG; MPN-ALT: NCP176BMX330TCG; MPN-ALT2: MIC5528-3.3YMT-T5
U601 = WCH:CH340C
X201 = Generics_stg:TCXO; MPN: ECS-TXO-25CSMV-320-AM-TR; MPN-ALT: ASTX-13-D-32,000MHZ-I05-T; MPN-ALT2: ATX-12-F-32,000MHZ-F05-T; MPN-ALT3: ECS-TXO-2520-33-320-AN
X401 = Generics_stg:CRYSTAL-GND: Crystal, oscillator; MPN: X322525MOB4SI

## Net classes
0 default: width 0.152 mm
1 LORA_RF: width 0.349 mm, clearance 0.203 mm to class 0, clearance 0.203 mm
2 ETH_DP: width 0.203 mm, clearance 0.3 mm to class 0, clearance 0.203 mm
3 CHASSIS_GND: clearance 0.5 mm to class 0, clearance 0.5 mm to class 1, clearance 0.5 mm to class 2, clearance 0.5 mm